# Altium project PCB_TDT4295_NTNU_2013.PrjPcb (part 1 of 2)
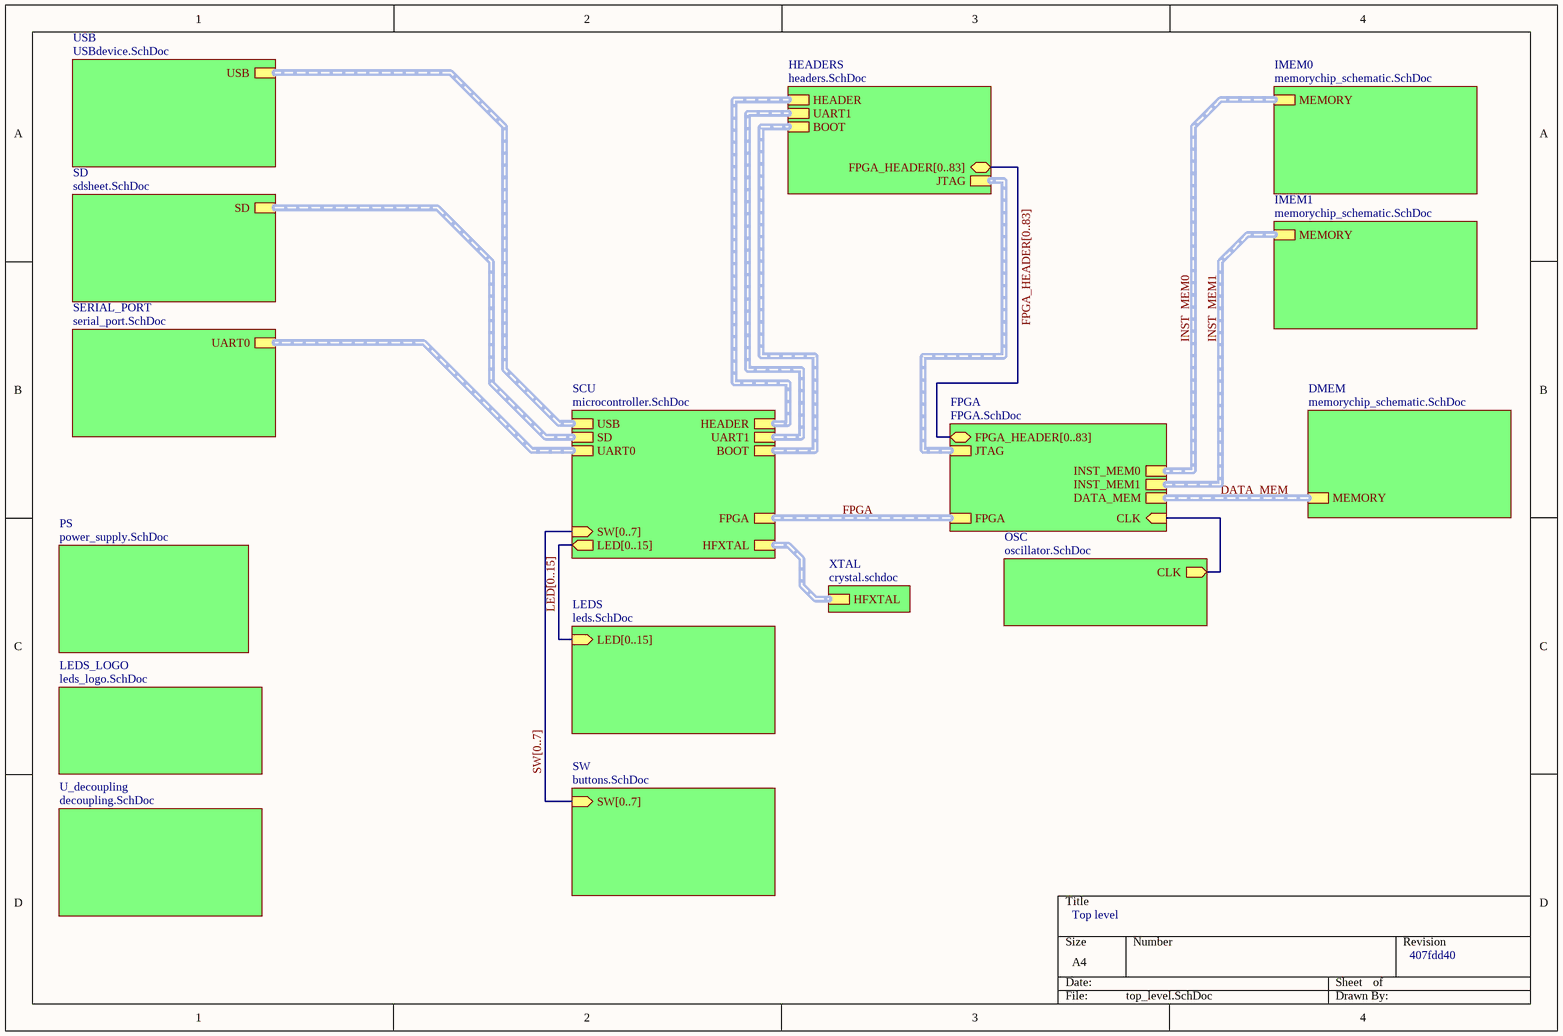
[diagram p0: top_level.SchDoc]
17 sheets, 168 parts. Net scope: hierarchical (ports join the sheet entries above them; power ports are global).
Board file: barricelli.PcbDoc
Sheets:
  top_level.SchDoc
    PS = power_supply.SchDoc
      U_psu_toggle_switch = psu_toggle_switch.SchDoc
    LEDS = leds.SchDoc
    SW = buttons.SchDoc
    SERIAL_PORT = serial_port.SchDoc
    IMEM0 = memorychip_schematic.SchDoc
    IMEM1 = memorychip_schematic.SchDoc
    DMEM = memorychip_schematic.SchDoc
    SCU = microcontroller.SchDoc
      U_microcontroller_reset_button = microcontroller_reset_button.schdoc
    FPGA = FPGA.SchDoc
    USB = USBdevice.SchDoc
    SD = sdsheet.SchDoc
    HEADERS = headers.SchDoc
    XTAL = crystal.schdoc
    OSC = oscillator.SchDoc
    LEDS_LOGO = leds_logo.SchDoc
    U_decoupling = decoupling.SchDoc

## Sheet top_level.SchDoc
size A4

### Sub-sheets
DMEM = memorychip_schematic.SchDoc: MEMORY (harness MEMORY)
FPGA = FPGA.SchDoc: FPGA (harness FPGA), DATA_MEM (harness MEMORY), INST_MEM0 (harness MEMORY), INST_MEM1 (harness MEMORY), JTAG (harness FPGA JTAG), CLK (in), FPGA_HEADER[0..83] (bidir)
HEADERS = headers.SchDoc: FPGA_HEADER[0..83] (bidir), UART1 (harness UART1), BOOT (harness BOOT), HEADER (harness HEADER), JTAG (harness FPGA JTAG)
IMEM0 = memorychip_schematic.SchDoc: MEMORY (harness MEMORY)
IMEM1 = memorychip_schematic.SchDoc: MEMORY (harness MEMORY)
LEDS = leds.SchDoc: LED[0..15] (in)
LEDS_LOGO = leds_logo.SchDoc: no entries
OSC = oscillator.SchDoc: CLK (out)
PS = power_supply.SchDoc: no entries
SCU = microcontroller.SchDoc: SW[0..7] (in), LED[0..15] (out), UART0 (harness UART0), FPGA (harness FPGA), HFXTAL (harness HFXTAL), UART1 (harness UART1), USB (harness USB), BOOT (harness BOOT), SD (harness SD), HEADER (harness HEADER)
SD = sdsheet.SchDoc: SD (harness SD)
SERIAL_PORT = serial_port.SchDoc: UART0 (harness UART0)
SW = buttons.SchDoc: SW[0..7] (in)
U_decoupling = decoupling.SchDoc: no entries
USB = USBdevice.SchDoc: USB (harness USB)
XTAL = crystal.schdoc: HFXTAL (harness HFXTAL)

### Nets
CLK: sheet FPGA/CLK, sheet OSC/CLK

### Buses and harness runs
bus FPGA_HEADER[0..83] = sheet FPGA/FPGA_HEADER[0..83] = sheet HEADERS/FPGA_HEADER[0..83]
bus LED[0..15] = sheet LEDS/LED[0..15] = sheet SCU/LED[0..15]
bus SW[0..7] = sheet SCU/SW[0..7] = sheet SW/SW[0..7]
harness DATA_MEM = sheet DMEM/MEMORY = sheet FPGA/DATA_MEM
harness FPGA = sheet FPGA/FPGA = sheet SCU/FPGA
harness INST_MEM0 = sheet FPGA/INST_MEM0 = sheet IMEM0/MEMORY
harness INST_MEM1 = sheet FPGA/INST_MEM1 = sheet IMEM1/MEMORY
harness sheet FPGA/JTAG = sheet HEADERS/JTAG
harness sheet HEADERS/BOOT = sheet SCU/BOOT
harness sheet HEADERS/HEADER = sheet SCU/HEADER
harness sheet HEADERS/UART1 = sheet SCU/UART1
harness sheet SCU/HFXTAL = sheet XTAL/HFXTAL
harness sheet SCU/SD = sheet SD/SD
harness sheet SCU/UART0 = sheet SERIAL_PORT/UART0
harness sheet SCU/USB = sheet USB/USB

### Notes on the sheet
- Top level
- 407fdd40

## Sheet power_supply.SchDoc
size A4
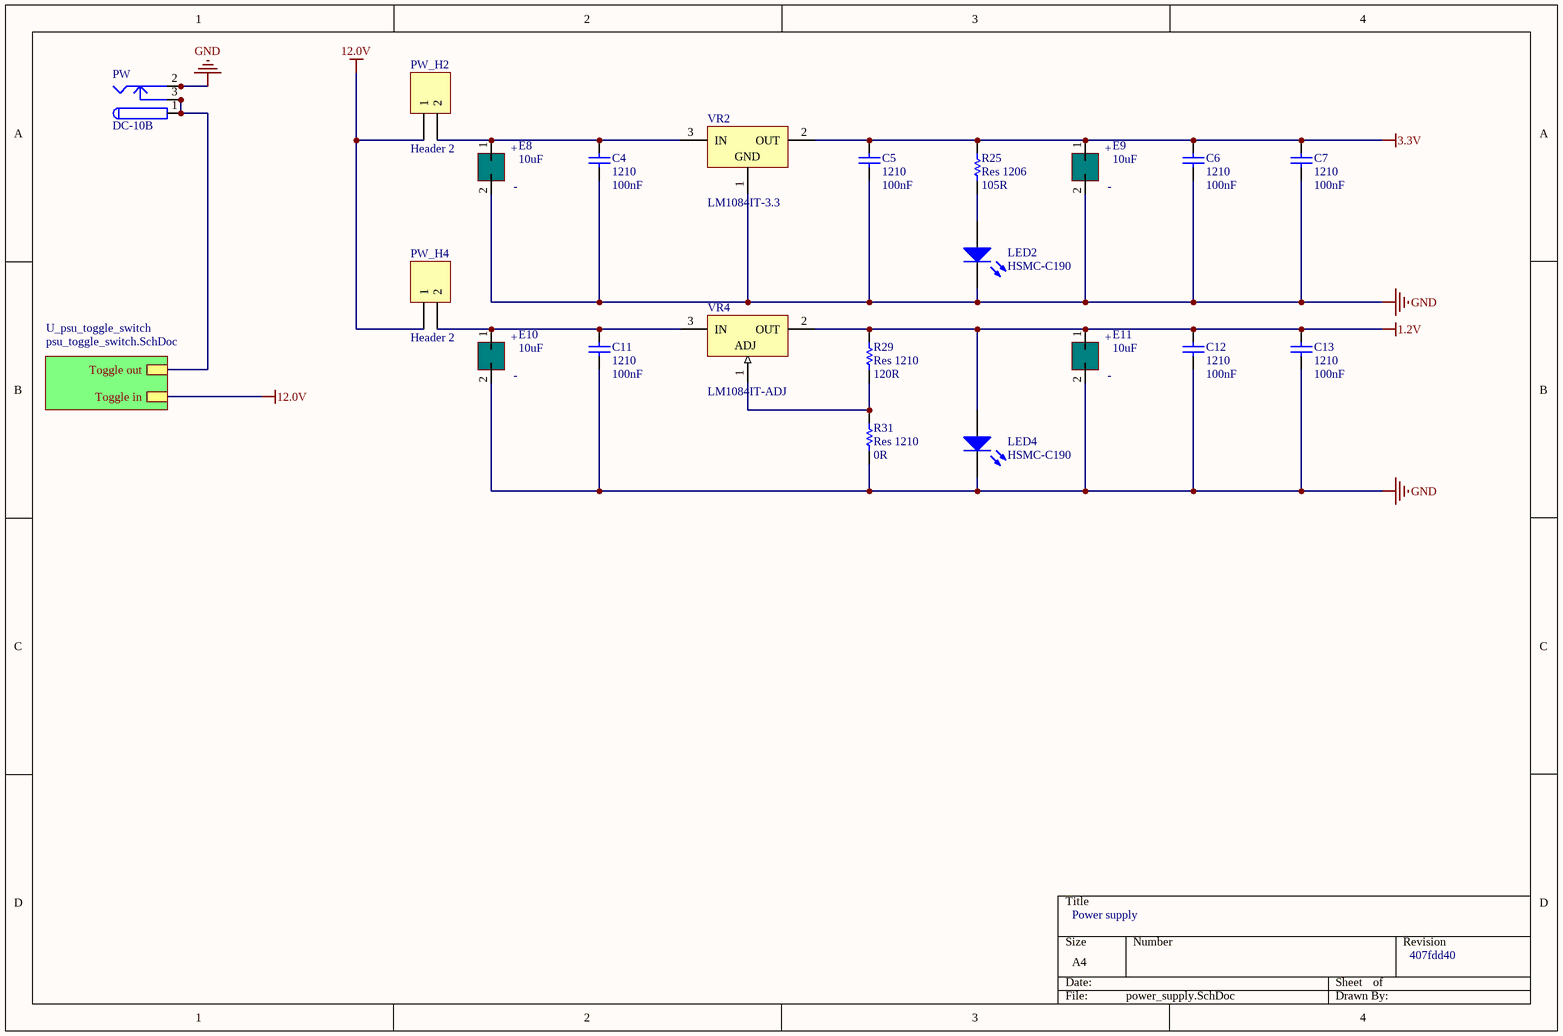
[diagram p1: power_supply.SchDoc]

### Parts
C4  1210  value 100nF  [CAPC1210(3225)105_L]
C5  1210  value 100nF  [CAPC1210(3225)105_L]
C6  1210  value 100nF  [CAPC1210(3225)105_L]
C7  1210  value 100nF  [CAPC1210(3225)105_L]
C11  1210  value 100nF  [CAPC1210(3225)105_L]
C12  1210  value 100nF  [CAPC1210(3225)105_L]
C13  1210  value 100nF  [CAPC1210(3225)105_L]
E8  10uF  [cap_pol_size_B]
E9  10uF  [cap_pol_size_B]
E10  10uF  [cap_pol_size_B]
E11  10uF  [cap_pol_size_B]
LED2  HSMC-C190  [1.6X0.8X0.8]
LED4  HSMC-C190  [1.6X0.8X0.8]
PW  DC-10B  [KLD-0202]
PW_H2  Header 2  [HDR1X2]
PW_H4  Header 2  [HDR1X2]
R25  Res 1206  value 105R  [RESC1206(3216)_L]
R29  Res 1210  value 120R  [RESC1210(3225)_M]
R31  Res 1210  value 0R  [RESC1210(3225)_M]
VR2  LM1084IT-3.3  [T03B]
VR4  LM1084IT-ADJ  [T03B]

### Sub-sheets
U_psu_toggle_switch = psu_toggle_switch.SchDoc: Toggle in, Toggle out

### Nets
1.2V: C12.2 C13.2 E11.1 LED4.1(A) R29.2 VR4.2(OUT)
3.3V: C5.2 C6.2 C7.2 E9.1 R25.1 VR2.2(OUT)
12.0V: PW_H2.1 PW_H4.1 ; sheet U_psu_toggle_switch/Toggle in
GND: C4.1 C5.1 C6.1 C7.1 C11.1 C12.1 C13.1 E8.2 E9.2 E10.2 E11.2 LED2.2(K) LED4.2(K) PW.2 PW.2A PW.2B R31.1 VR2.1(GND)
Toggle out: PW.1 PW.1A PW.1B PW.3 PW.3A PW.3B ; sheet U_psu_toggle_switch/Toggle out
NetC4_2: C4.2 E8.1 PW_H2.2 VR2.3(IN)
NetC11_2: C11.2 E10.1 PW_H4.2 VR4.3(IN)
NetLED2_1: LED2.1(A) R25.2
NetR29_1: R29.1 R31.2 VR4.1(ADJ)

### Notes on the sheet
- Power supply
- 407fdd40
- (in symbol CAP_POL_SIZE_B) +; -

### Library data of the parts
C4-C7 C11-C13 = CMP-1038-01663-1: CAP 100nF 100V ±5% 1210 (3225 Metric) Thickness 1.05mm SMD; Case-Metric: 3225; Max Thickness: 1.05 mm; Rated Voltage: 100 V; Tolerance: ±5%; Case-EIA: 1210; Technology: SMT
E8-E11 = CAP_POL_SIZE_B: size B series S type V capacitor, panasonic elec
LED2 LED4 = HSMC-C190: High Performance Chip LED, Red; LuminousIntensity: 25mcd (Minimum).; PCB_Layout: Complies with manufacturer's recommendation.; Published: 11-Dec-2002; DatasheetVersion: 11-Mar-2002; PackageVersion: Mar-2002; PackageReference: 1.6X0.8X0.8; Publisher: Altium Limited; PackageDescription: SM LED; 2 Flat Leads; LED_Colour: Red; ComponentLink1Description: Manufacturer Link; ComponentLink1URL: http://www.avagotech.com/; ComponentLink2Description: Datasheet; ComponentLink2URL: http://cp.literature.agilent.com/litweb/pdf/5988-5891EN.pdf
PW = PWR2.5: Low Voltage Power Supply Connector; Published: 17-Dec-2003; DatasheetDocument: 09-May-2002; Publisher: Altium Limited; ComponentLink1Description: Manufacturer Link; ComponentLink1URL: http://domino.kycon.com/internet/Products.html
PW_H2 PW_H4 = Header 2: Header, 2-Pin; LatestRevisionDate: 17-Jul-2002; LatestRevisionNote: Re-released for DXP Platform.; Publisher: Altium Limited
R25 = CMP-1014-00056-1: 105R 0.25W 5% 1206 (3216 Metric)  SMD; Case-Metric: 3216; Case-EIA: 1206; Technology: SMT; Tolerance: 5 %; Power: 0.25 W
R29 = CMP-1015-00405-1: 120R 0.5W 1% 1210 (3225 Metric)  SMD; Case-Metric: 3225; Case-EIA: 1210; Technology: SMT; Tolerance: 1 %; Power: 0.5 W
R31 = CMP-1015-00405-1: 0R 0.5W 1% 1210 (3225 Metric)  SMD; Case-Metric: 3225; Case-EIA: 1210; Technology: SMT; Tolerance: 1 %; Power: 0.5 W
VR2 = LM1084IT-3.3: 5A Low Dropout Positive Regulators, 3-pin TO-220; Manufacturer: National Semiconductor; PackageTopMarking: NSUZXYTTE#*LM1084*IT-3.3; PowerWise: N; CompType: LDO IC; Published: 4-Dec-2008; DatasheetVersion: Jun-2005; PackageVersion: revL, Jan-1992; PackageReference: T03B; Publisher: Altium Limited; PackageDescription: TO-220, Molded, 3 Lead, Straight; Supplier 1: Farnell; Supplier Part Number 1: 4975467; PartNumber: LM1084IT-3.3; RoHS: N; PinCount: 3; ComponentLink1Description: LM1084 Datasheet; ComponentLink1URL: http://www.national.com/ds/LM/LM1084.pdf; ComponentLink2Description: LM1084 Web Page; ComponentLink2URL: http://www.national.com/pf/LM/LM1084.html; ComponentLink3Description: T03B Package Page; ComponentLink3URL: http://www.national.com/packaging/folders/t03b.html
VR4 = LM1084IT-ADJ: 5A Low Dropout Positive Regulators, 3-pin TO-220; Manufacturer: National Semiconductor; PackageTopMarking: NSUZXYTTE#*LM1084*IT-ADJ; PowerWise: N; CompType: LDO IC; Published: 4-Dec-2008; DatasheetVersion: Jun-2005; PackageVersion: revL, Jan-1992; PackageReference: T03B; Publisher: Altium Limited; PackageDescription: TO-220, Molded, 3 Lead, Straight; Supplier 1: Farnell; Supplier Part Number 1: 7610087; PartNumber: LM1084IT-ADJ; RoHS: N; PinCount: 3; ComponentLink1Description: LM1084 Datasheet; ComponentLink1URL: http://www.national.com/ds/LM/LM1084.pdf; ComponentLink2Description: LM1084 Web Page; ComponentLink2URL: http://www.national.com/pf/LM/LM1084.html; ComponentLink3Description: T03B Package Page; ComponentLink3URL: http://www.national.com/packaging/folders/t03b.html

## Sheet psu_toggle_switch.SchDoc
size A4
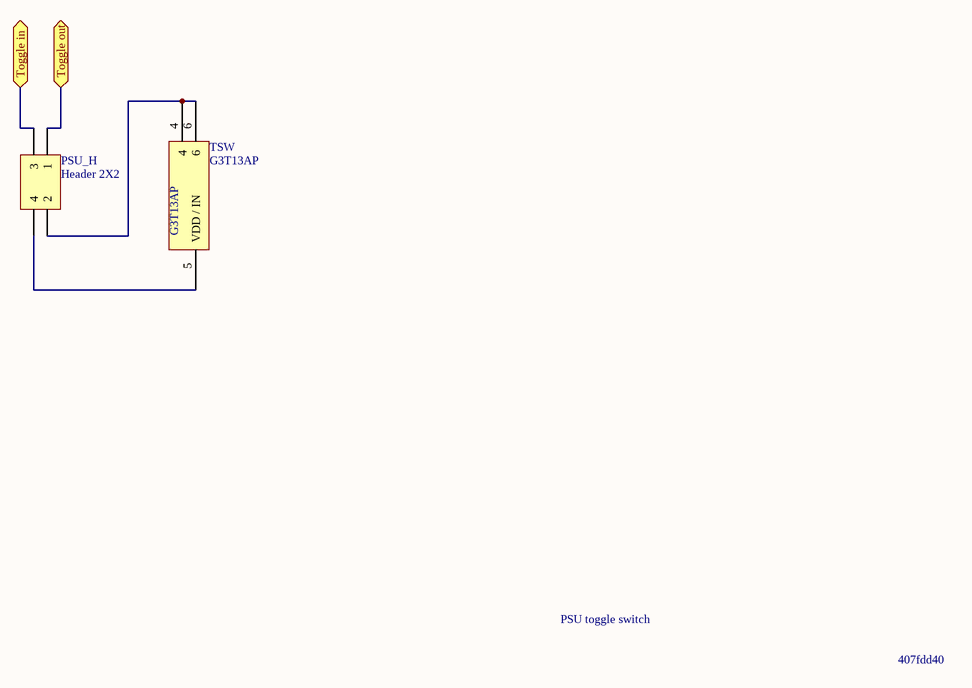
[diagram p2: psu_toggle_switch.SchDoc]

### Parts
PSU_H  Header 2X2  [HDR2X2]
TSW  G3T13AP  [G3T13AP]

### Ports
Toggle in, Toggle out

### Nets
12.0V: PSU_H.3 ; port Toggle in
Toggle out: PSU_H.1 ; port Toggle out
NetPSU_H_2: PSU_H.2 TSW.4 TSW.6
NetPSU_H_4: PSU_H.4 TSW.5(VDD_/_IN)

### Notes on the sheet
- PSU toggle switch
- 407fdd40

### Library data of the parts
PSU_H = Header 2X2: Header, 2-Pin, Dual row; LatestRevisionDate: 17-Jul-2002; LatestRevisionNote: Re-released for DXP Platform.; Publisher: Altium Limited

## Sheet leds.SchDoc
size A4
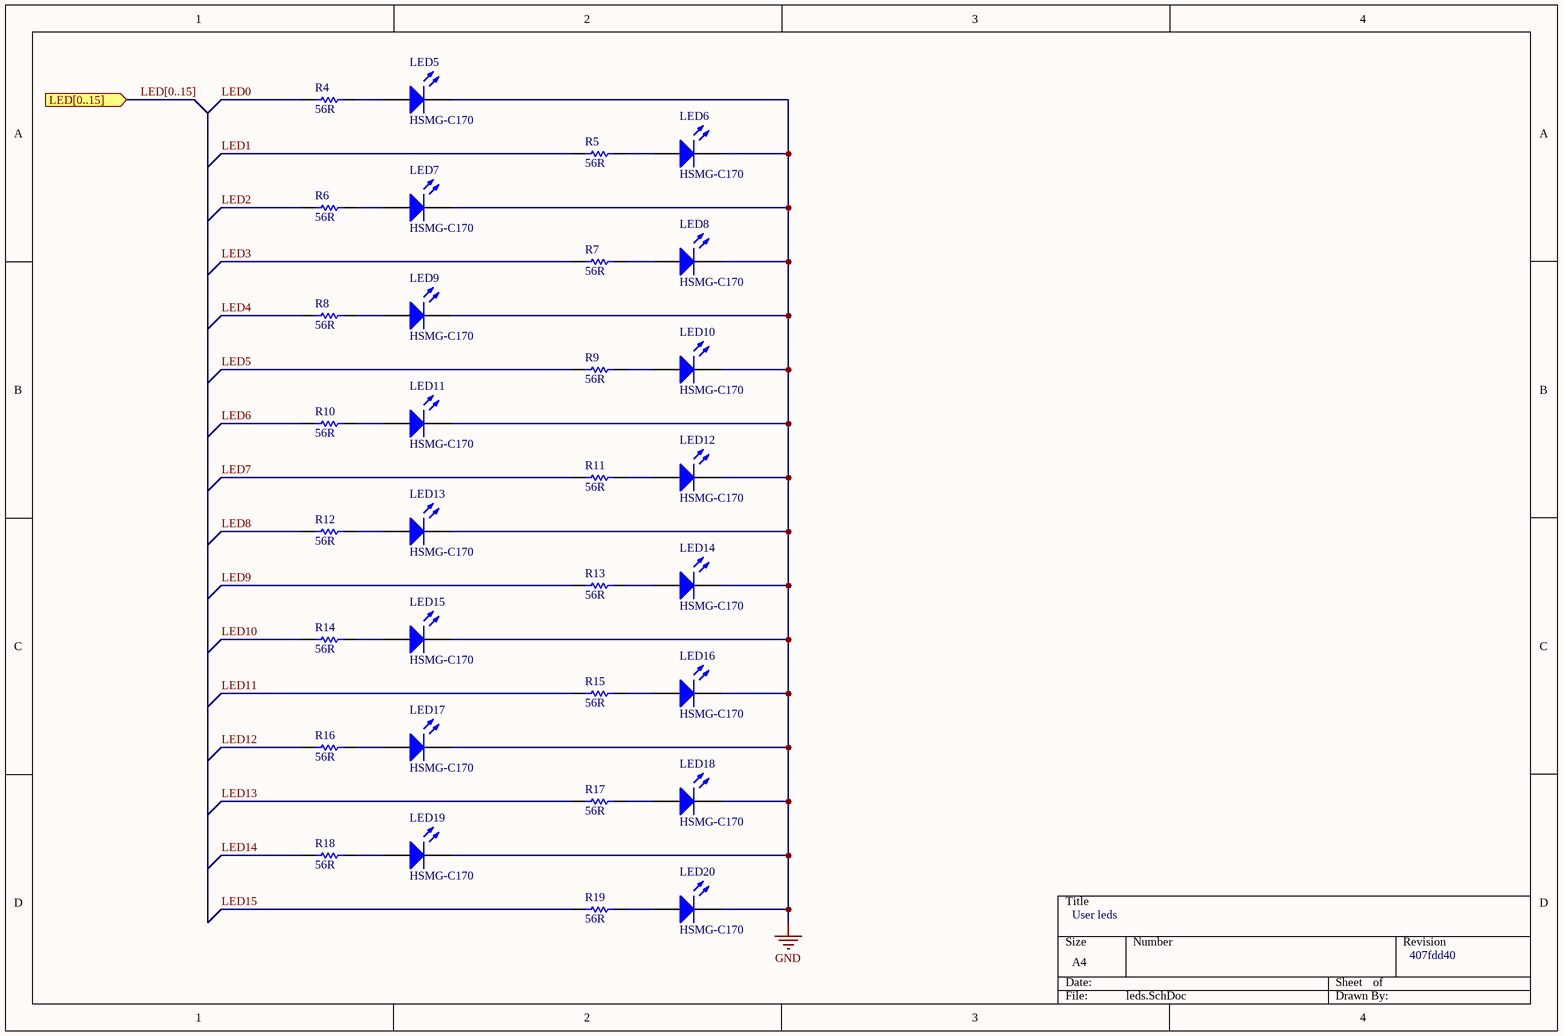
[diagram p3: leds.SchDoc]

### Parts
LED5  HSMG-C170  [2.0X1.25X0.8]
LED6  HSMG-C170  [2.0X1.25X0.8]
LED7  HSMG-C170  [2.0X1.25X0.8]
LED8  HSMG-C170  [2.0X1.25X0.8]
LED9  HSMG-C170  [2.0X1.25X0.8]
LED10  HSMG-C170  [2.0X1.25X0.8]
LED11  HSMG-C170  [2.0X1.25X0.8]
LED12  HSMG-C170  [2.0X1.25X0.8]
LED13  HSMG-C170  [2.0X1.25X0.8]
LED14  HSMG-C170  [2.0X1.25X0.8]
LED15  HSMG-C170  [2.0X1.25X0.8]
LED16  HSMG-C170  [2.0X1.25X0.8]
LED17  HSMG-C170  [2.0X1.25X0.8]
LED18  HSMG-C170  [2.0X1.25X0.8]
LED19  HSMG-C170  [2.0X1.25X0.8]
LED20  HSMG-C170  [2.0X1.25X0.8]
R4  value 56R  [RESC1206(3216)_N]  (hidden comment: 56R 5% 1206(3216))
R5  value 56R  [RESC1206(3216)_N]  (hidden comment: 56R 5% 1206(3216))
R6  value 56R  [RESC1206(3216)_N]  (hidden comment: 56R 5% 1206(3216))
R7  value 56R  [RESC1206(3216)_N]  (hidden comment: 56R 5% 1206(3216))
R8  value 56R  [RESC1206(3216)_N]  (hidden comment: 56R 5% 1206(3216))
R9  value 56R  [RESC1206(3216)_N]  (hidden comment: 56R 5% 1206(3216))
R10  value 56R  [RESC1206(3216)_N]  (hidden comment: 56R 5% 1206(3216))
R11  value 56R  [RESC1206(3216)_N]  (hidden comment: 56R 5% 1206(3216))
R12  value 56R  [RESC1206(3216)_N]  (hidden comment: 56R 5% 1206(3216))
R13  value 56R  [RESC1206(3216)_N]  (hidden comment: 56R 5% 1206(3216))
R14  value 56R  [RESC1206(3216)_N]  (hidden comment: 56R 5% 1206(3216))
R15  value 56R  [RESC1206(3216)_N]  (hidden comment: 56R 5% 1206(3216))
R16  value 56R  [RESC1206(3216)_N]  (hidden comment: 56R 5% 1206(3216))
R17  value 56R  [RESC1206(3216)_N]  (hidden comment: 56R 5% 1206(3216))
R18  value 56R  [RESC1206(3216)_N]  (hidden comment: 56R 5% 1206(3216))
R19  value 56R  [RESC1206(3216)_N]  (hidden comment: 56R 5% 1206(3216))

### Ports
LED[0..15] (in)

### Nets
GND: LED5.2(K) LED6.2(K) LED7.2(K) LED8.2(K) LED9.2(K) LED10.2(K) LED11.2(K) LED12.2(K) LED13.2(K) LED14.2(K) LED15.2(K) LED16.2(K) LED17.2(K) LED18.2(K) LED19.2(K) LED20.2(K)
LED0: R4.1
LED1: R5.1
LED2: R6.1
LED3: R7.1
LED4: R8.1
LED5: R9.1
LED6: R10.1
LED7: R11.1
LED8: R12.1
LED9: R13.1
LED10: R14.1
LED11: R15.1
LED12: R16.1
LED13: R17.1
LED14: R18.1
LED15: R19.1
NetLED5_1: LED5.1(A) R4.2
NetLED6_1: LED6.1(A) R5.2
NetLED7_1: LED7.1(A) R6.2
NetLED8_1: LED8.1(A) R7.2
NetLED9_1: LED9.1(A) R8.2
NetLED10_1: LED10.1(A) R9.2
NetLED11_1: LED11.1(A) R10.2
NetLED12_1: LED12.1(A) R11.2
NetLED13_1: LED13.1(A) R12.2
NetLED14_1: LED14.1(A) R13.2
NetLED15_1: LED15.1(A) R14.2
NetLED16_1: LED16.1(A) R15.2
NetLED17_1: LED17.1(A) R16.2
NetLED18_1: LED18.1(A) R17.2
NetLED19_1: LED19.1(A) R18.2
NetLED20_1: LED20.1(A) R19.2

### Buses and harness runs
bus LED[0..15] = port LED[0..15]

### Notes on the sheet
- User leds
- 407fdd40

### Library data of the parts
LED5-LED20 = HSMG-C170: Surface Mount Chip LED, Green; LuminousIntensity: 4mcd (Minimum).; PCB_Layout: Complies with manufacturer's recommendation.; Published: 11-Dec-2002; DatasheetVersion: 30-Apr-2002; PackageVersion: Oct-2001; PackageReference: 2.0X1.25X0.8; Publisher: Altium Limited; PackageDescription: SM LED; 2 Flat Leads; LED_Colour: Green; ComponentLink1Description: Manufacturer Link; ComponentLink1URL: http://www.avagotech.com/; ComponentLink2Description: Datasheet; ComponentLink2URL: http://cp.literature.agilent.com/litweb/pdf/5988-6271EN.pdf
R4-R19 = CMP-1014-00044-1: 56R 0.25W 5% 1206 (3216 Metric)  SMD; Case-EIA: 1206; Case-Metric: 3216; Technology: SMT; Tolerance: 5 %; Power: 0.25 W

## Sheet buttons.SchDoc
size A4
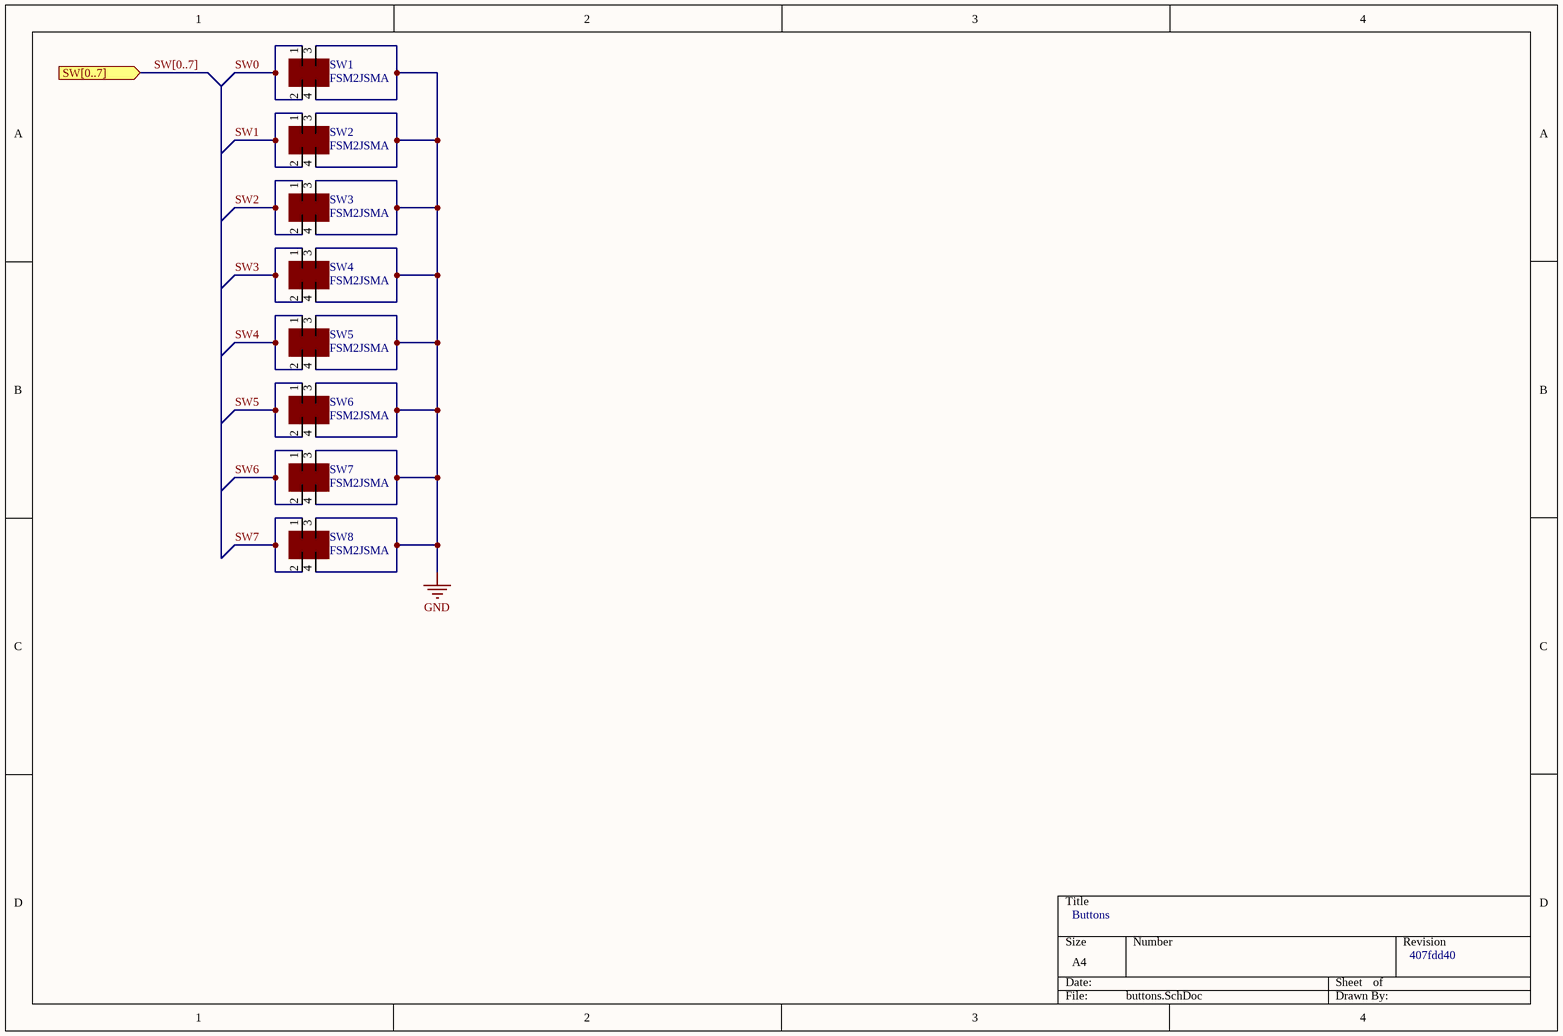
[diagram p4: buttons.SchDoc]

### Parts
SW1  FSM2JSMA  [Button]
SW2  FSM2JSMA  [Button]
SW3  FSM2JSMA  [Button]
SW4  FSM2JSMA  [Button]
SW5  FSM2JSMA  [Button]
SW6  FSM2JSMA  [Button]
SW7  FSM2JSMA  [Button]
SW8  FSM2JSMA  [Button]

### Ports
SW[0..7] (in)

### Nets
GND: SW1.3 SW1.4 SW2.3 SW2.4 SW3.3 SW3.4 SW4.3 SW4.4 SW5.3 SW5.4 SW6.3 SW6.4 SW7.3 SW7.4 SW8.3 SW8.4
SW0: SW1.1 SW1.2
SW1: SW2.1 SW2.2
SW2: SW3.1 SW3.2
SW3: SW4.1 SW4.2
SW4: SW5.1 SW5.2
SW5: SW6.1 SW6.2
SW6: SW7.1 SW7.2
SW7: SW8.1 SW8.2

### Buses and harness runs
bus SW[0..7] = port SW[0..7]

### Notes on the sheet
- Buttons
- 407fdd40

### Library data of the parts
SW1-SW8 = switch-button

## Sheet serial_port.SchDoc
size A4
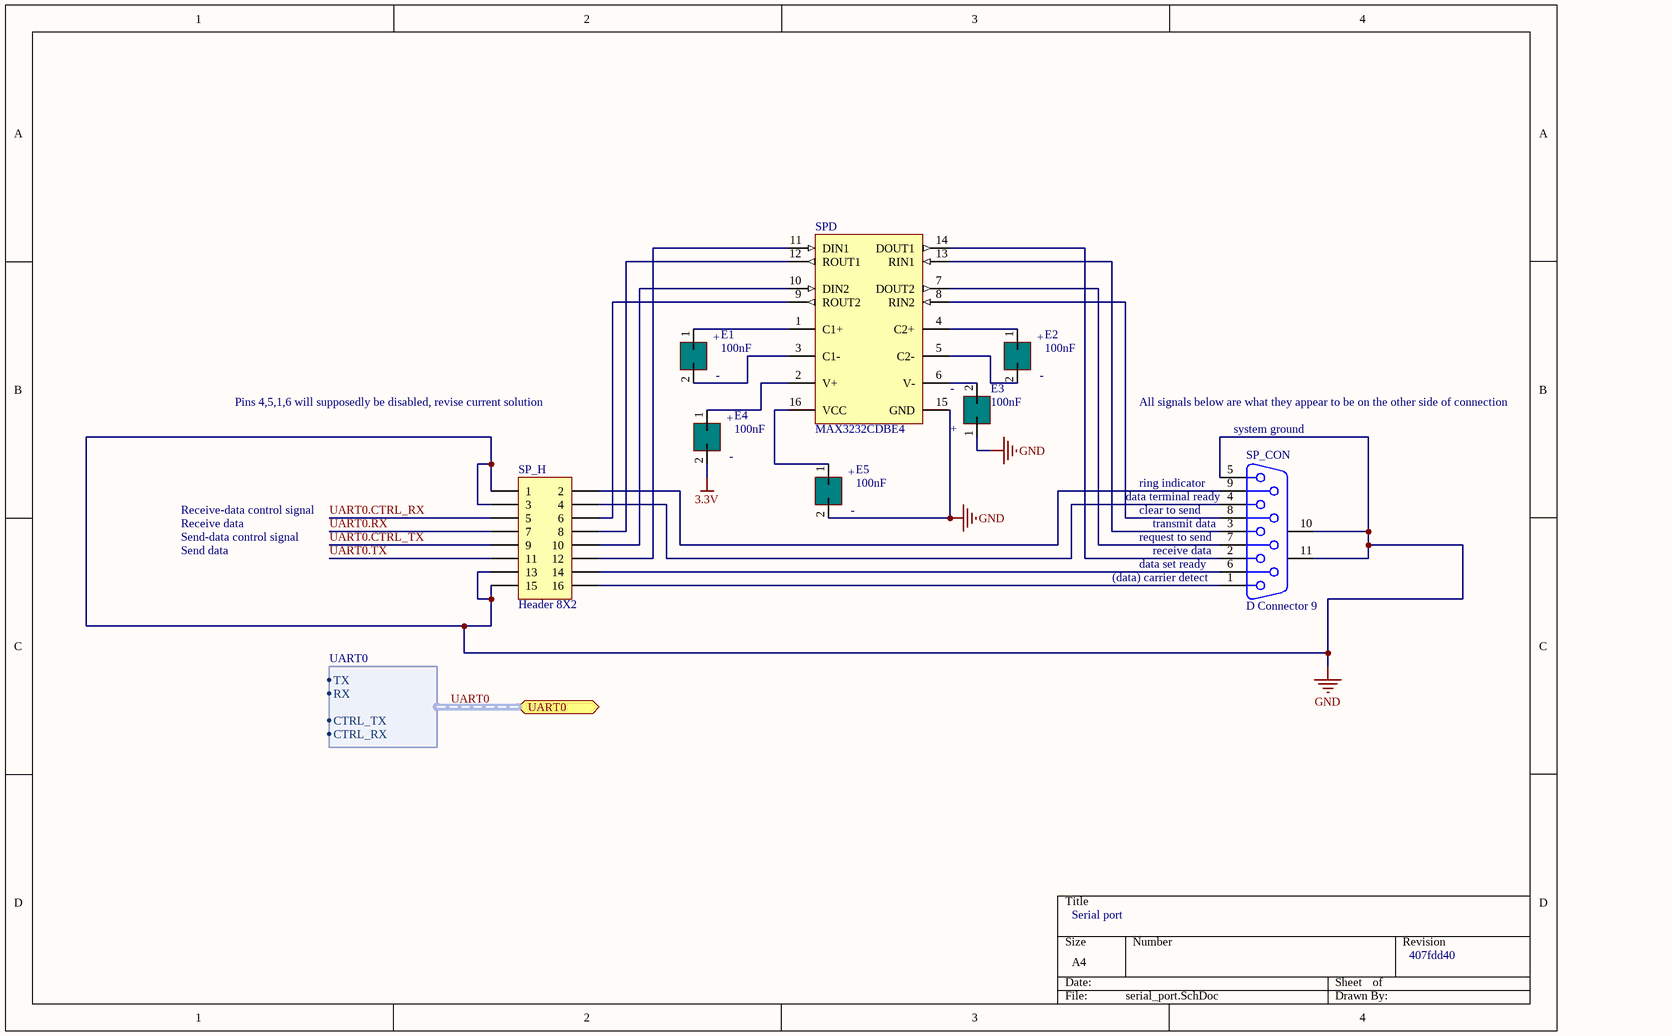
[diagram p5: serial_port.SchDoc]

### Parts
E1  100nF  [cap_pol_size_B]
E2  100nF  [cap_pol_size_B]
E3  100nF  [cap_pol_size_B]
E4  100nF  [cap_pol_size_B]
E5  100nF  [cap_pol_size_B]
SP_CON  D Connector 9  [DSUB1.385-2H9]
SP_H  Header 8X2  [HDR2X8]
SPD  MAX3232CDBE4  [TI-DB16_L]

### Ports
UART0 (harness UART0)

### Harnesses
UART0: TX, RX, CTRL_TX, CTRL_RX

### Nets
3.3V: E4.2
GND: E3.1 E5.2 SP_CON.5 SP_CON.10(MH1) SP_CON.11(MH2) SP_H.1 SP_H.3 SP_H.13 SP_H.15 SPD.15(GND)
UART0.CTRL_RX: SP_H.5
UART0.CTRL_TX: SP_H.9
UART0.RX: SP_H.7
UART0.TX: SP_H.11
NetE1_1: E1.1 SPD.1(C1+)
NetE1_2: E1.2 SPD.3(C1-)
NetE2_1: E2.1 SPD.4(C2+)
NetE2_2: E2.2 SPD.5(C2-)
NetE3_2: E3.2 SPD.6(V-)
NetE4_1: E4.1 SPD.2(V+)
NetE5_1: E5.1 SPD.16(VCC)
NetSP_CON_1: SP_CON.1 SP_H.16
NetSP_CON_2: SP_CON.2 SPD.14(DOUT1)
NetSP_CON_3: SP_CON.3 SPD.13(RIN1)
NetSP_CON_4: SP_CON.4 SP_H.4
NetSP_CON_6: SP_CON.6 SP_H.14
NetSP_CON_7: SP_CON.7 SPD.7(DOUT2)
NetSP_CON_8: SP_CON.8 SPD.8(RIN2)
NetSP_CON_9: SP_CON.9 SP_H.2
NetSP_H_6: SP_H.6 SPD.9(ROUT2)
NetSP_H_8: SP_H.8 SPD.12(ROUT1)
NetSP_H_10: SP_H.10 SPD.10(DIN2)
NetSP_H_12: SP_H.12 SPD.11(DIN1)

### Buses and harness runs
harness UART0 = port UART0

### Notes on the sheet
- Pins 4,5,1,6 will supposedly be disabled, revise current solution
- All signals below are what they appear to be on the other side of connection
- (near SP_CON) system ground
- Receive-data control signal
- (near SP_CON) data terminal ready
- (near SP_CON) clear to send
- (near SP_CON) ring indicator
- Send data
- Send-data control signal
- Receive data
- (near SP_CON) (data) carrier detect
- (near SP_CON) request to send
- (near SP_CON) data set ready
- (near SP_CON) transmit data
- (near SP_CON) receive data
- Serial port
- 407fdd40
- (in symbol CAP_POL_SIZE_B) +; -

### Library data of the parts
E1-E5 = CAP_POL_SIZE_B: as E8 on sheet power_supply
SP_CON = D Connector 9: Receptacle Assembly, 9 Position, Right Angle; PackageDocument: O; Positions: 9; Published: 15-Jun-2001; LatestRevisionDate: 17-Jul-2002; LatestRevisionNote: Re-released for DXP Platform.; DatasheetDocument: 1-Sep-1999; PackageReference: 788750; Publisher: Altium Limited; Orientation: Right Angle; Gender: Receptacle
SP_H = Header 8X2: Header, 8-Pin, Dual row; LatestRevisionDate: 17-Jul-2002; LatestRevisionNote: Re-released for DXP Platform.; Publisher: Altium Limited
SPD = CMP-0299-01177-1: 3-V to 5.5-V Multichannel RS-232 Line Driver / Receiver with ±15-kV ESD Protection, 0 to 70 degC, 16-Pin SSOP (DB), Green (RoHS & no Sb/Br); RS-232: TRUE; Supply Voltage(s)(V): 3.3 or 5.0; ESD HBM(kV): +/-15; ICC(Max)(mA): 1; Drivers Per Package: 2; SubFamily: RS-232; ComponentLink1URL: www.ti.com; ComponentLink3Description: Package Specification; PackageDescription: 16-Pin Plastic Small Outline Package, 6.2 x 5.3 mm Body, 0.65 mm Pitch; ComponentLink2URL: http://www.ti.com/general/docs/lit/getliterature.tsp?genericPartNumber=MAX3232&fileType=pdf; Single Supply: TRUE; ComponentLink3URL: http://www.ti.com/litv/pdf/msso002e; PackageVersion: revE, Dec-2001; ComponentLink1Description: Manufacturer URL; ComponentLink2Description: Datasheet; Receivers Per Package: 2; DatasheetVersion: SLLS410I; PackageReference: DB16

## Sheet memorychip_schematic.SchDoc
size A4
Used 3 times, as channels IMEM0, IMEM1, DMEM. Parts and nets are listed once, with the designators drawn on the sheet.
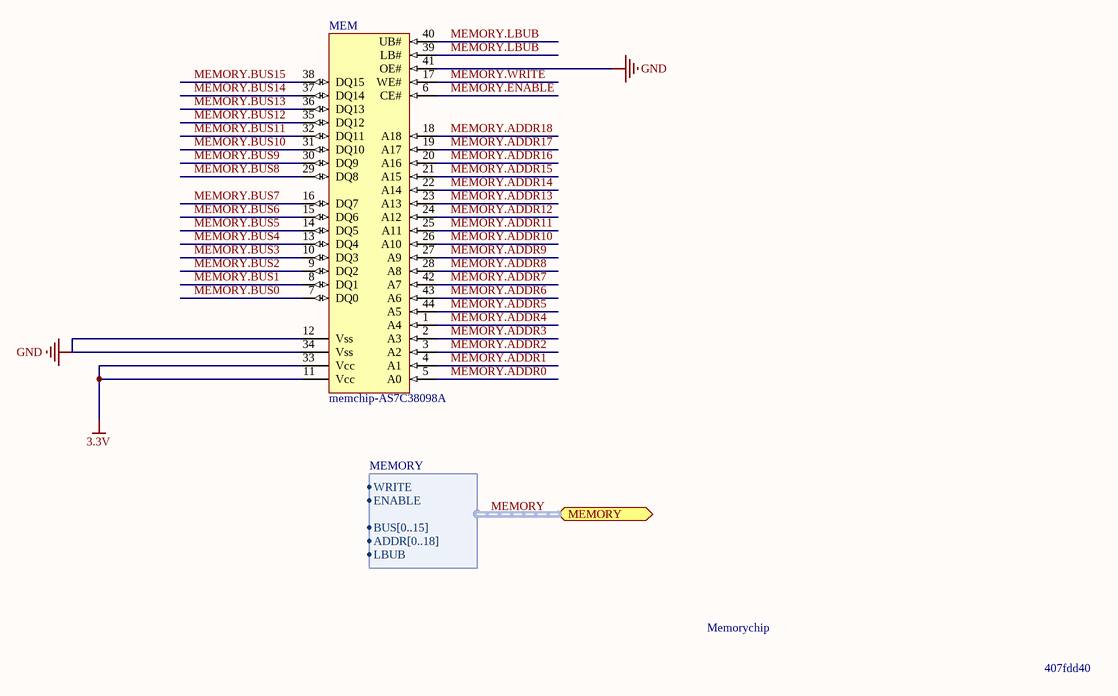
[diagram p6: memorychip_schematic.SchDoc]

### Parts
MEM  memchip-AS7C38098A  [AS7C38098A-10TIN]

### Ports
MEMORY (harness MEMORY)

### Harnesses
MEMORY: WRITE, ENABLE, ADDR[0..18], BUS[0..15], LBUB

### Nets
3.3V: MEM.11(Vcc) MEM.33(Vcc)
GND: MEM.12(Vss) MEM.34(Vss) MEM.41(OE#)
MEMORY.ADDR0: MEM.5(A0)
MEMORY.ADDR1: MEM.4(A1)
MEMORY.ADDR2: MEM.3(A2)
MEMORY.ADDR3: MEM.2(A3)
MEMORY.ADDR4: MEM.1(A4)
MEMORY.ADDR5: MEM.44(A5)
MEMORY.ADDR6: MEM.43(A6)
MEMORY.ADDR7: MEM.42(A7)
MEMORY.ADDR8: MEM.28(A8)
MEMORY.ADDR9: MEM.27(A9)
MEMORY.ADDR10: MEM.26(A10)
MEMORY.ADDR11: MEM.25(A11)
MEMORY.ADDR12: MEM.24(A12)
MEMORY.ADDR13: MEM.23(A13)
MEMORY.ADDR14: MEM.22(A14)
MEMORY.ADDR15: MEM.21(A15)
MEMORY.ADDR16: MEM.20(A16)
MEMORY.ADDR17: MEM.19(A17)
MEMORY.ADDR18: MEM.18(A18)
MEMORY.BUS0: MEM.7(DQ0)
MEMORY.BUS1: MEM.8(DQ1)
MEMORY.BUS2: MEM.9(DQ2)
MEMORY.BUS3: MEM.10(DQ3)
MEMORY.BUS4: MEM.13(DQ4)
MEMORY.BUS5: MEM.14(DQ5)
MEMORY.BUS6: MEM.15(DQ6)
MEMORY.BUS7: MEM.16(DQ7)
MEMORY.BUS8: MEM.29(DQ8)
MEMORY.BUS9: MEM.30(DQ9)
MEMORY.BUS10: MEM.31(DQ10)
MEMORY.BUS11: MEM.32(DQ11)
MEMORY.BUS12: MEM.35(DQ12)
MEMORY.BUS13: MEM.36(DQ13)
MEMORY.BUS14: MEM.37(DQ14)
MEMORY.BUS15: MEM.38(DQ15)
MEMORY.ENABLE: MEM.6(CE#)
MEMORY.LBUB: MEM.39(LB#) MEM.40(UB#)
MEMORY.WRITE: MEM.17(WE#)

### Channels
IMEM0: designators end in _IMEM0
IMEM1: designators end in _IMEM1
DMEM: designators end in _DMEM

### Buses and harness runs
harness MEMORY = port MEMORY

### Notes on the sheet
- Memorychip
- 407fdd40

## Sheet microcontroller.SchDoc
size A3
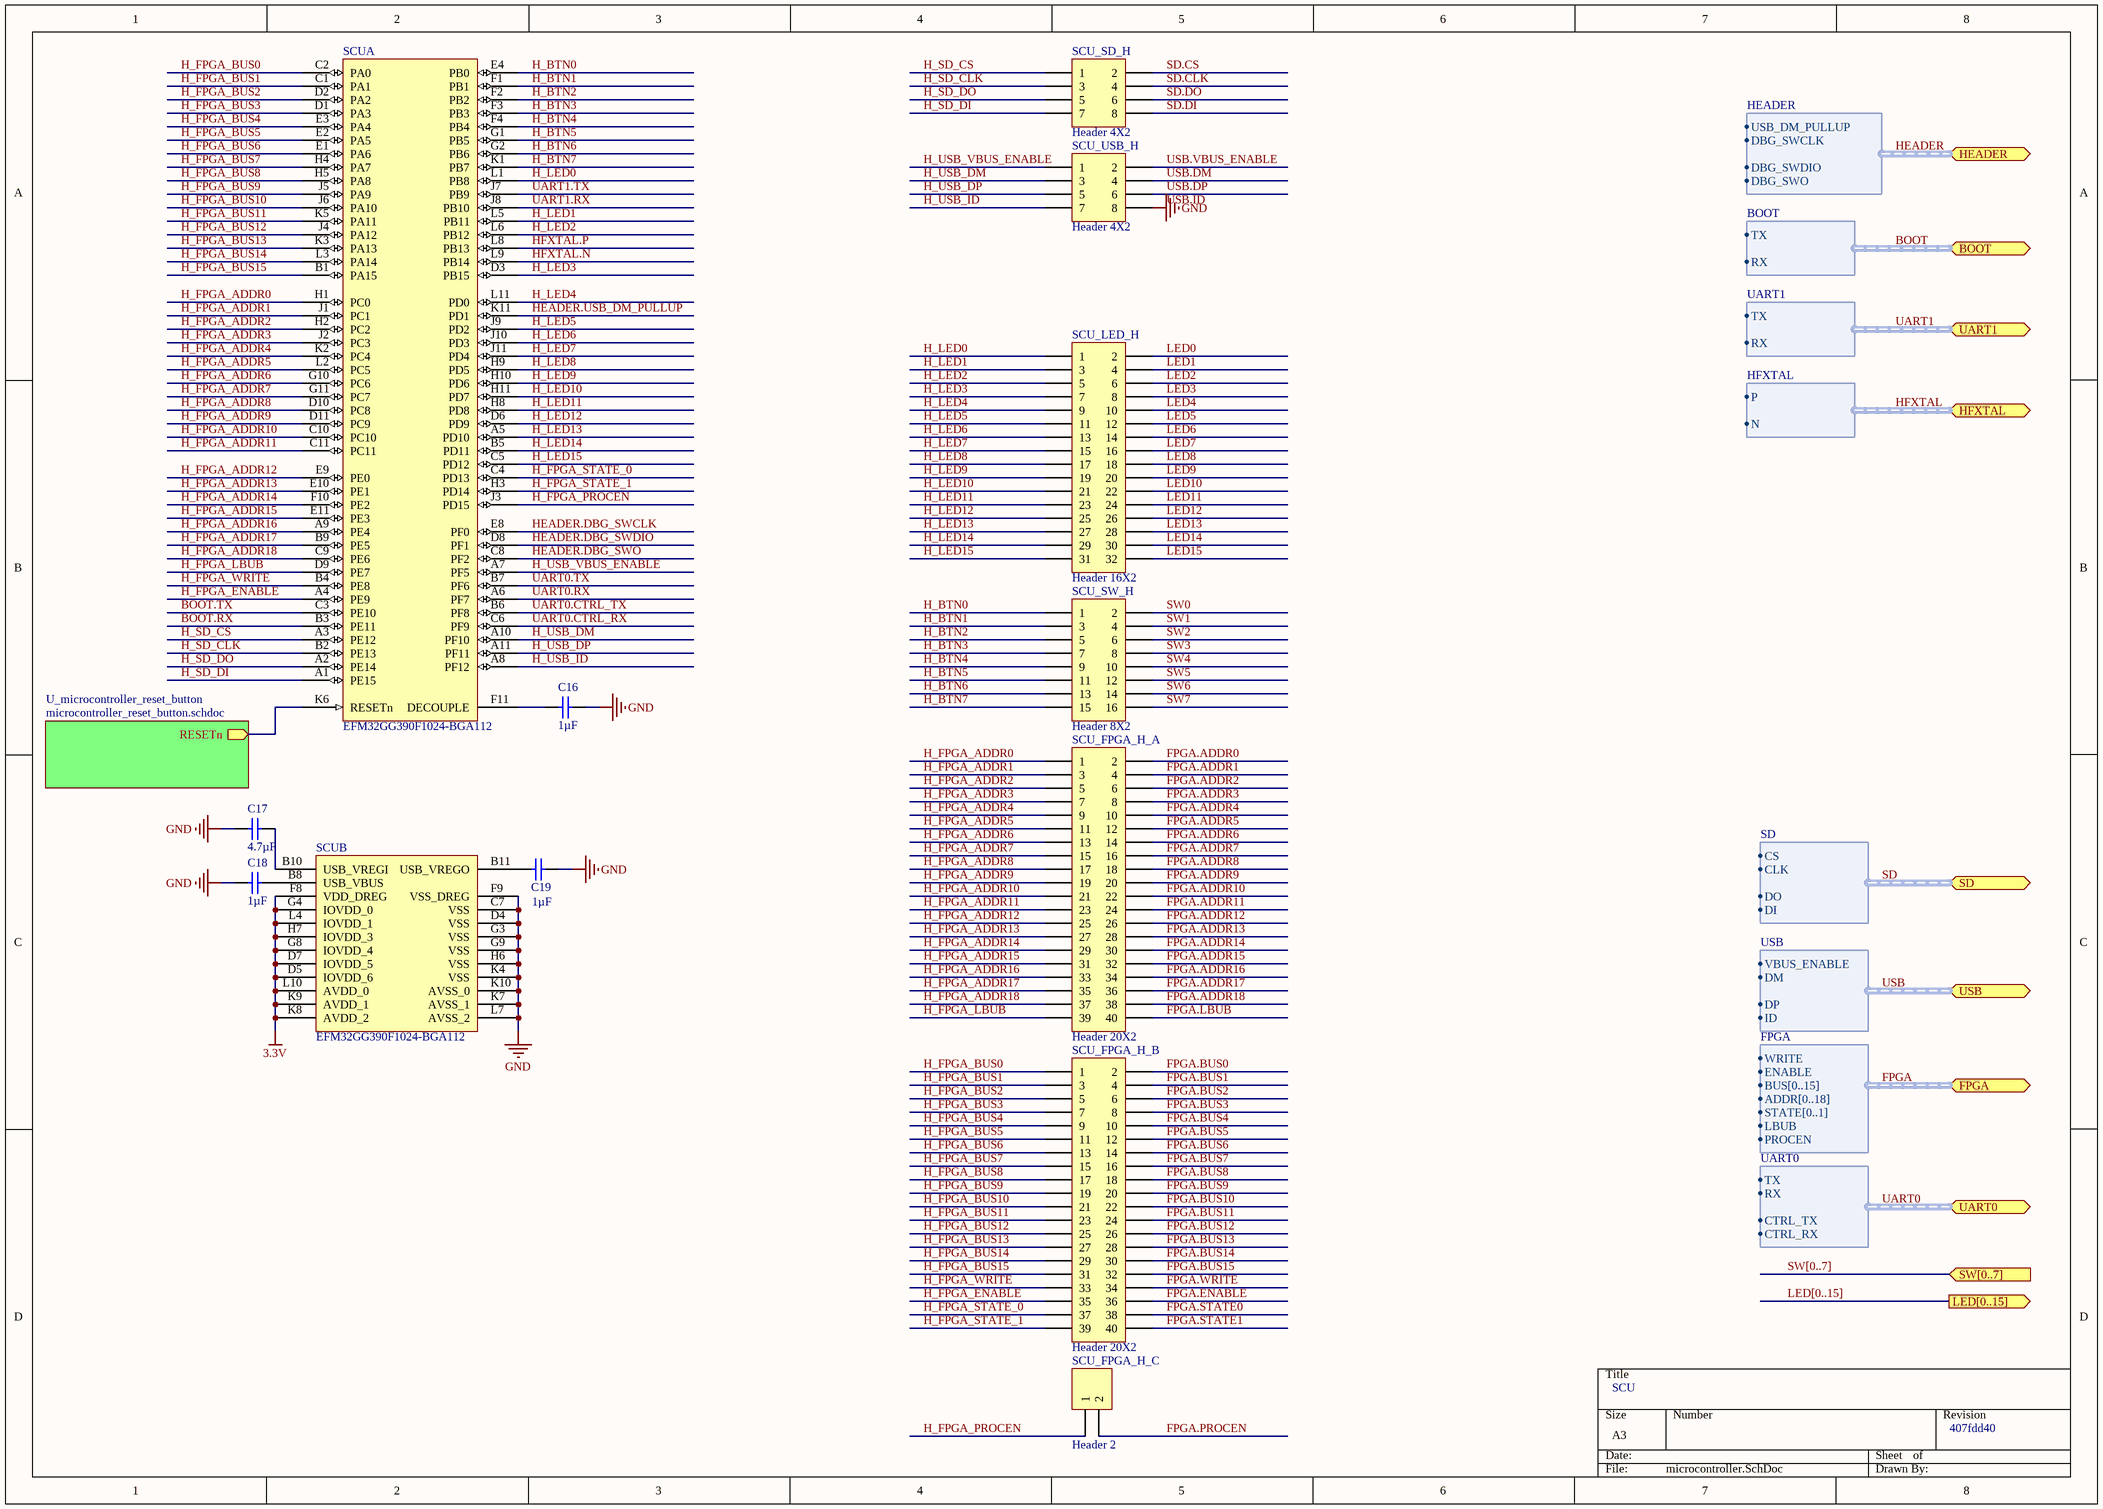
[diagram p7: microcontroller.SchDoc]

### Parts
C16  value 1µF  [CAPC1210(3225)100_L]  (hidden comment: CAP 1uF 100V 1210(3225))
C17  value 4.7µF  [CAPC1210(3225)100_L]  (hidden comment: CAP 4.7uF 100V 1210(3225))
C18  value 1µF  [CAPC1210(3225)100_L]  (hidden comment: CAP 1uF 100V 1210(3225))
C19  value 1µF  [CAPC1210(3225)100_L]  (hidden comment: CAP 1uF 100V 1210(3225))
SCU  EFM32GG390F1024-BGA112  [ENMR-BGA112]  (parts A,B of 2)
SCU_FPGA_H_A  Header 20X2  [HDR2X20]
SCU_FPGA_H_B  Header 20X2  [HDR2X20]
SCU_FPGA_H_C  Header 2  [HDR1X2]
SCU_LED_H  Header 16X2  [HDR2X16]
SCU_SD_H  Header 4X2  [HDR2X4]
SCU_SW_H  Header 8X2  [HDR2X8]
SCU_USB_H  Header 4X2  [HDR2X4]

### Sub-sheets
U_microcontroller_reset_button = microcontroller_reset_button.schdoc: RESETn (out)

### Ports
BOOT (harness BOOT), FPGA (harness FPGA), HEADER (harness HEADER), HFXTAL (harness HFXTAL), LED[0..15] (out), SD (harness SD), SW[0..7] (in), UART0 (harness UART0), UART1 (harness UART1), USB (harness USB)

### Harnesses
UART0: TX, RX, CTRL_TX, CTRL_RX
FPGA: WRITE, ENABLE, ADDR[0..18], STATE[0..1], BUS[0..15], LBUB, PROCEN
HFXTAL: P, N
UART1: TX, RX
USB: VBUS_ENABLE, DM, DP, ID
BOOT: TX, RX
SD: CS, CLK, DO, DI
HEADER: USB_DM_PULLUP, DBG_SWCLK, DBG_SWDIO, DBG_SWO

### Nets
3.3V: SCU.D5(IOVDD_6) SCU.D7(IOVDD_5) SCU.F8(VDD_DREG) SCU.G4(IOVDD_0) SCU.G8(IOVDD_4) SCU.H7(IOVDD_3) SCU.K8(AVDD_2) SCU.K9(AVDD_1) SCU.L4(IOVDD_1) SCU.L10(AVDD_0)
GND: C16.2 C17.2 C18.2 C19.2 SCU.C7(VSS) SCU.D4(VSS) SCU.F9(VSS_DREG) SCU.G3(VSS) SCU.G9(VSS) SCU.H6(VSS) SCU.K4(VSS) SCU.K7(AVSS_1) SCU.K10(AVSS_0) SCU.L7(AVSS_2) SCU_USB_H.8
BOOT.RX: SCU.B3(PE11)
BOOT.TX: SCU.C3(PE10)
FPGA.ADDR0: SCU_FPGA_H_A.2
FPGA.ADDR1: SCU_FPGA_H_A.4
FPGA.ADDR2: SCU_FPGA_H_A.6
FPGA.ADDR3: SCU_FPGA_H_A.8
FPGA.ADDR4: SCU_FPGA_H_A.10
FPGA.ADDR5: SCU_FPGA_H_A.12
FPGA.ADDR6: SCU_FPGA_H_A.14
FPGA.ADDR7: SCU_FPGA_H_A.16
FPGA.ADDR8: SCU_FPGA_H_A.18
FPGA.ADDR9: SCU_FPGA_H_A.20
FPGA.ADDR10: SCU_FPGA_H_A.22
FPGA.ADDR11: SCU_FPGA_H_A.24
FPGA.ADDR12: SCU_FPGA_H_A.26
FPGA.ADDR13: SCU_FPGA_H_A.28
FPGA.ADDR14: SCU_FPGA_H_A.30
FPGA.ADDR15: SCU_FPGA_H_A.32
FPGA.ADDR16: SCU_FPGA_H_A.34
FPGA.ADDR17: SCU_FPGA_H_A.36
FPGA.ADDR18: SCU_FPGA_H_A.38
FPGA.BUS0: SCU_FPGA_H_B.2
FPGA.BUS1: SCU_FPGA_H_B.4
FPGA.BUS2: SCU_FPGA_H_B.6
FPGA.BUS3: SCU_FPGA_H_B.8
FPGA.BUS4: SCU_FPGA_H_B.10
FPGA.BUS5: SCU_FPGA_H_B.12
FPGA.BUS6: SCU_FPGA_H_B.14
FPGA.BUS7: SCU_FPGA_H_B.16
FPGA.BUS8: SCU_FPGA_H_B.18
FPGA.BUS9: SCU_FPGA_H_B.20
FPGA.BUS10: SCU_FPGA_H_B.22
FPGA.BUS11: SCU_FPGA_H_B.24
FPGA.BUS12: SCU_FPGA_H_B.26
FPGA.BUS13: SCU_FPGA_H_B.28
FPGA.BUS14: SCU_FPGA_H_B.30
FPGA.BUS15: SCU_FPGA_H_B.32
FPGA.ENABLE: SCU_FPGA_H_B.36
FPGA.LBUB: SCU_FPGA_H_A.40
FPGA.PROCEN: SCU_FPGA_H_C.2
FPGA.STATE0: SCU_FPGA_H_B.38
FPGA.STATE1: SCU_FPGA_H_B.40
FPGA.WRITE: SCU_FPGA_H_B.34
H_BTN0: SCU.E4(PB0) SCU_SW_H.1
H_BTN1: SCU.F1(PB1) SCU_SW_H.3
H_BTN2: SCU.F2(PB2) SCU_SW_H.5
H_BTN3: SCU.F3(PB3) SCU_SW_H.7
H_BTN4: SCU.F4(PB4) SCU_SW_H.9
H_BTN5: SCU.G1(PB5) SCU_SW_H.11
H_BTN6: SCU.G2(PB6) SCU_SW_H.13
H_BTN7: SCU.K1(PB7) SCU_SW_H.15
H_FPGA_ADDR0: SCU.H1(PC0) SCU_FPGA_H_A.1
H_FPGA_ADDR1: SCU.J1(PC1) SCU_FPGA_H_A.3
H_FPGA_ADDR2: SCU.H2(PC2) SCU_FPGA_H_A.5
H_FPGA_ADDR3: SCU.J2(PC3) SCU_FPGA_H_A.7
H_FPGA_ADDR4: SCU.K2(PC4) SCU_FPGA_H_A.9
H_FPGA_ADDR5: SCU.L2(PC5) SCU_FPGA_H_A.11
H_FPGA_ADDR6: SCU.G10(PC6) SCU_FPGA_H_A.13
H_FPGA_ADDR7: SCU.G11(PC7) SCU_FPGA_H_A.15
H_FPGA_ADDR8: SCU.D10(PC8) SCU_FPGA_H_A.17
H_FPGA_ADDR9: SCU.D11(PC9) SCU_FPGA_H_A.19
H_FPGA_ADDR10: SCU.C10(PC10) SCU_FPGA_H_A.21
H_FPGA_ADDR11: SCU.C11(PC11) SCU_FPGA_H_A.23
H_FPGA_ADDR12: SCU.E9(PE0) SCU_FPGA_H_A.25
H_FPGA_ADDR13: SCU.E10(PE1) SCU_FPGA_H_A.27
H_FPGA_ADDR14: SCU.F10(PE2) SCU_FPGA_H_A.29
H_FPGA_ADDR15: SCU.E11(PE3) SCU_FPGA_H_A.31
H_FPGA_ADDR16: SCU.A9(PE4) SCU_FPGA_H_A.33
H_FPGA_ADDR17: SCU.B9(PE5) SCU_FPGA_H_A.35
H_FPGA_ADDR18: SCU.C9(PE6) SCU_FPGA_H_A.37
H_FPGA_BUS0: SCU.C2(PA0) SCU_FPGA_H_B.1
H_FPGA_BUS1: SCU.C1(PA1) SCU_FPGA_H_B.3
H_FPGA_BUS2: SCU.D2(PA2) SCU_FPGA_H_B.5
H_FPGA_BUS3: SCU.D1(PA3) SCU_FPGA_H_B.7
H_FPGA_BUS4: SCU.E3(PA4) SCU_FPGA_H_B.9
H_FPGA_BUS5: SCU.E2(PA5) SCU_FPGA_H_B.11
H_FPGA_BUS6: SCU.E1(PA6) SCU_FPGA_H_B.13
H_FPGA_BUS7: SCU.H4(PA7) SCU_FPGA_H_B.15
H_FPGA_BUS8: SCU.H5(PA8) SCU_FPGA_H_B.17
H_FPGA_BUS9: SCU.J5(PA9) SCU_FPGA_H_B.19
H_FPGA_BUS10: SCU.J6(PA10) SCU_FPGA_H_B.21
H_FPGA_BUS11: SCU.K5(PA11) SCU_FPGA_H_B.23
H_FPGA_BUS12: SCU.J4(PA12) SCU_FPGA_H_B.25
H_FPGA_BUS13: SCU.K3(PA13) SCU_FPGA_H_B.27
H_FPGA_BUS14: SCU.L3(PA14) SCU_FPGA_H_B.29
H_FPGA_BUS15: SCU.B1(PA15) SCU_FPGA_H_B.31
H_FPGA_ENABLE: SCU.A4(PE9) SCU_FPGA_H_B.35
H_FPGA_LBUB: SCU.D9(PE7) SCU_FPGA_H_A.39
H_FPGA_PROCEN: SCU.J3(PD15) SCU_FPGA_H_C.1
H_FPGA_STATE_0: SCU.C4(PD13) SCU_FPGA_H_B.37
H_FPGA_STATE_1: SCU.H3(PD14) SCU_FPGA_H_B.39
H_FPGA_WRITE: SCU.B4(PE8) SCU_FPGA_H_B.33
H_LED0: SCU.L1(PB8) SCU_LED_H.1
H_LED1: SCU.L5(PB11) SCU_LED_H.3
H_LED2: SCU.L6(PB12) SCU_LED_H.5
H_LED3: SCU.D3(PB15) SCU_LED_H.7
H_LED4: SCU.L11(PD0) SCU_LED_H.9
H_LED5: SCU.J9(PD2) SCU_LED_H.11
H_LED6: SCU.J10(PD3) SCU_LED_H.13
H_LED7: SCU.J11(PD4) SCU_LED_H.15
H_LED8: SCU.H9(PD5) SCU_LED_H.17
H_LED9: SCU.H10(PD6) SCU_LED_H.19
H_LED10: SCU.H11(PD7) SCU_LED_H.21
H_LED11: SCU.H8(PD8) SCU_LED_H.23
H_LED12: SCU.D6(PD9) SCU_LED_H.25
H_LED13: SCU.A5(PD10) SCU_LED_H.27
H_LED14: SCU.B5(PD11) SCU_LED_H.29
H_LED15: SCU.C5(PD12) SCU_LED_H.31
H_SD_CLK: SCU.B2(PE13) SCU_SD_H.3
H_SD_CS: SCU.A3(PE12) SCU_SD_H.1
H_SD_DI: SCU.A1(PE15) SCU_SD_H.7
H_SD_DO: SCU.A2(PE14) SCU_SD_H.5
H_USB_DM: SCU.A10(PF10) SCU_USB_H.3
H_USB_DP: SCU.A11(PF11) SCU_USB_H.5
H_USB_ID: SCU.A8(PF12) SCU_USB_H.7
H_USB_VBUS_ENABLE: SCU.A7(PF5) SCU_USB_H.1
HEADER.DBG_SWCLK: SCU.E8(PF0)
HEADER.DBG_SWDIO: SCU.D8(PF1)
HEADER.DBG_SWO: SCU.C8(PF2)
HEADER.USB_DM_PULLUP: SCU.K11(PD1)
HFXTAL.N: SCU.L9(PB14)
HFXTAL.P: SCU.L8(PB13)
LED0: SCU_LED_H.2
LED1: SCU_LED_H.4
LED2: SCU_LED_H.6
LED3: SCU_LED_H.8
LED4: SCU_LED_H.10
LED5: SCU_LED_H.12
LED6: SCU_LED_H.14
LED7: SCU_LED_H.16
LED8: SCU_LED_H.18
LED9: SCU_LED_H.20
LED10: SCU_LED_H.22
LED11: SCU_LED_H.24
LED12: SCU_LED_H.26
LED13: SCU_LED_H.28
LED14: SCU_LED_H.30
LED15: SCU_LED_H.32
RESETn: SCU.K6(RESETn) ; sheet U_microcontroller_reset_button/RESETn
SD.CLK: SCU_SD_H.4
SD.CS: SCU_SD_H.2
SD.DI: SCU_SD_H.8
SD.DO: SCU_SD_H.6
SW0: SCU_SW_H.2
SW1: SCU_SW_H.4
SW2: SCU_SW_H.6
SW3: SCU_SW_H.8
SW4: SCU_SW_H.10
SW5: SCU_SW_H.12
SW6: SCU_SW_H.14
SW7: SCU_SW_H.16
UART0.CTRL_RX: SCU.C6(PF9)
UART0.CTRL_TX: SCU.B6(PF8)
UART0.RX: SCU.A6(PF7)
UART0.TX: SCU.B7(PF6)
UART1.RX: SCU.J8(PB10)
UART1.TX: SCU.J7(PB9)
USB.DM: SCU_USB_H.4
USB.DP: SCU_USB_H.6
USB.VBUS_ENABLE: SCU_USB_H.2
NetC16_1: C16.1 SCU.F11(DECOUPLE)
NetC17_1: C17.1 SCU.B10(USB_VREGI)
NetC18_1: C18.1 SCU.B8(USB_VBUS)
NetC19_1: C19.1 SCU.B11(USB_VREGO)

### Buses and harness runs
bus LED[0..15] = port LED[0..15]
bus SW[0..7] = port SW[0..7]
harness BOOT = port BOOT
harness FPGA = port FPGA
harness HEADER = port HEADER
harness HFXTAL = port HFXTAL
harness SD = port SD
harness UART0 = port UART0
harness UART1 = port UART1
harness USB = port USB

### Notes on the sheet
- SCU
- 407fdd40
- Labels drawn without touching a wire or pin: USB.ID

### Library data of the parts
C16 C18 C19 = CMP-1038-00005-1: CAP 1uF 100V ±0.25pF 1210 (3225 Metric) Thickness 1mm SMD; Case-Metric: 3225; Case-EIA: 1210; Max Thickness: 1 mm; Rated Voltage: 100 V; Technology: SMT; Tolerance: ±0.25pF
C17 = CMP-1038-00005-1: CAP 4.7uF 100V ±0.25pF 1210 (3225 Metric) Thickness 1mm SMD; Case-Metric: 3225; Case-EIA: 1210; Max Thickness: 1 mm; Rated Voltage: 100 V; Technology: SMT; Tolerance: ±0.25pF
SCU = CMP-0270-00014-1: EFM32 Giant Gecko, M3 ARM Cortex CPU, 1024 KB Flash, 128 KB RAM, 1.85 - 3.8 V Supply, 48 MHz Max Speed, -40 to 85 degC, 112-Pin BGA, RoHS Compliant; LESENSE: Y; Max Speed (MHz): 48; Flash (KB): 1024; GPIO: 87; OPAMPS: 3; RAM (KB): 128; PackageDescription: 112-Pin Ball Grid Array, Body 10 x 10 mm, Pitch 0.8 mm; PartNumber: EFM32GG390F1024-BGA112; USB: Y; PackageReference: BGA112; PackageVersion: Rev. 97SPP01315A_X03_06Jun11; ComponentLink3Description: Package Specification; ComponentLink2Description: Datasheet; ComponentLink1URL: http://www.energymicro.com/; Generic Part Number: EFM32GG390; ARM Cortex CPU: M3; Subcategory: EFM32 Giant Gecko; DatasheetVersion: Rev 1.00; ComponentLink2URL: http://cdn.energymicro.com/dl/devices/pdf/d0040_efm32gg390_datasheet.pdf; Mounting Technology: Surface Mount; ComponentLink3URL: http://cdn.energymicro.com/dl/devices/pdf/d0007_efm32g290_datasheet.pdf; ComponentLink1Description: Manufacturer URL; Supply Voltage (V): 1.85 - 3.8
SCU_FPGA_H_A SCU_FPGA_H_B = Header 20X2: Header, 20-Pin, Dual row; LatestRevisionDate: 17-Jul-2002; LatestRevisionNote: Re-released for DXP Platform.; Publisher: Altium Limited
SCU_FPGA_H_C = Header 2: Header, 2-Pin; LatestRevisionDate: 17-Jul-2002; LatestRevisionNote: Re-released for DXP Platform.; Publisher: Altium Limited
SCU_LED_H = Header 16X2: Header, 16-Pin, Dual row; LatestRevisionDate: 17-Jul-2002; LatestRevisionNote: Re-released for DXP Platform.; Publisher: Altium Limited
SCU_SD_H SCU_USB_H = Header 4X2: Header, 4-Pin, Dual row; LatestRevisionDate: 17-Jul-2002; LatestRevisionNote: Re-released for DXP Platform.; Publisher: Altium Limited
SCU_SW_H = Header 8X2: Header, 8-Pin, Dual row; LatestRevisionDate: 17-Jul-2002; LatestRevisionNote: Re-released for DXP Platform.; Publisher: Altium Limited

## Sheet microcontroller_reset_button.schdoc
size A4
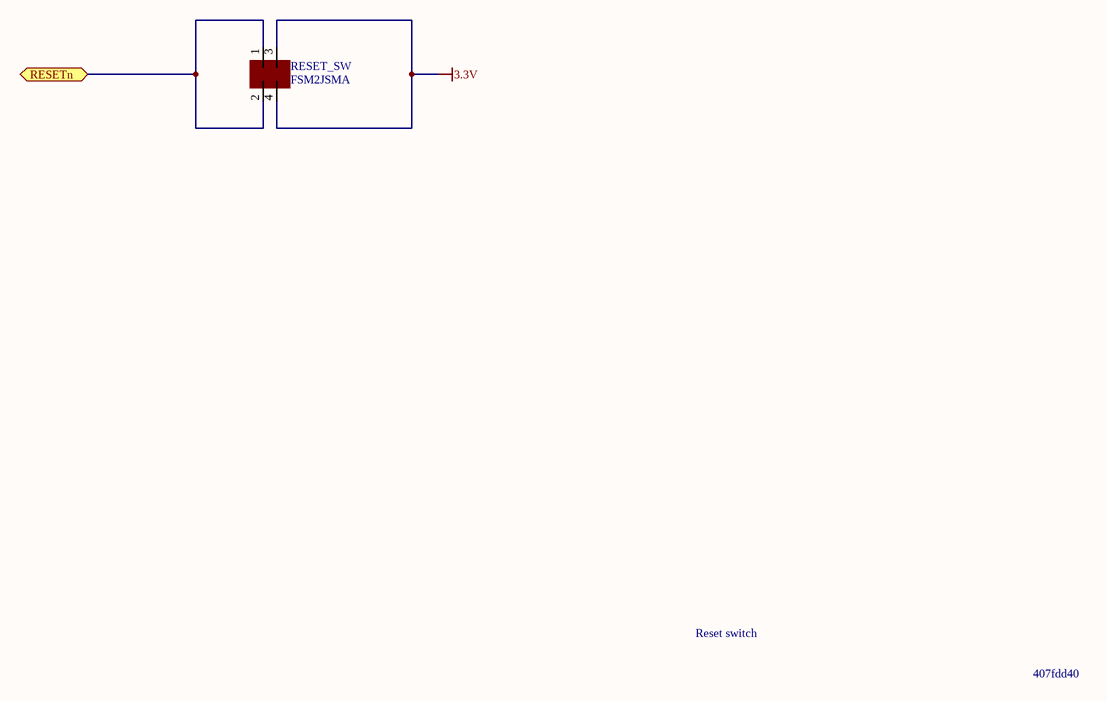
[diagram p8: microcontroller_reset_button.schdoc]

### Parts
RESET_SW  FSM2JSMA  [Button]

### Ports
RESETn

### Nets
3.3V: RESET_SW.3 RESET_SW.4
RESETn: RESET_SW.1 RESET_SW.2 ; port RESETn

### Notes on the sheet
- Reset switch
- 407fdd40

### Library data of the parts
RESET_SW = switch-button

## Sheet FPGA.SchDoc
size A3
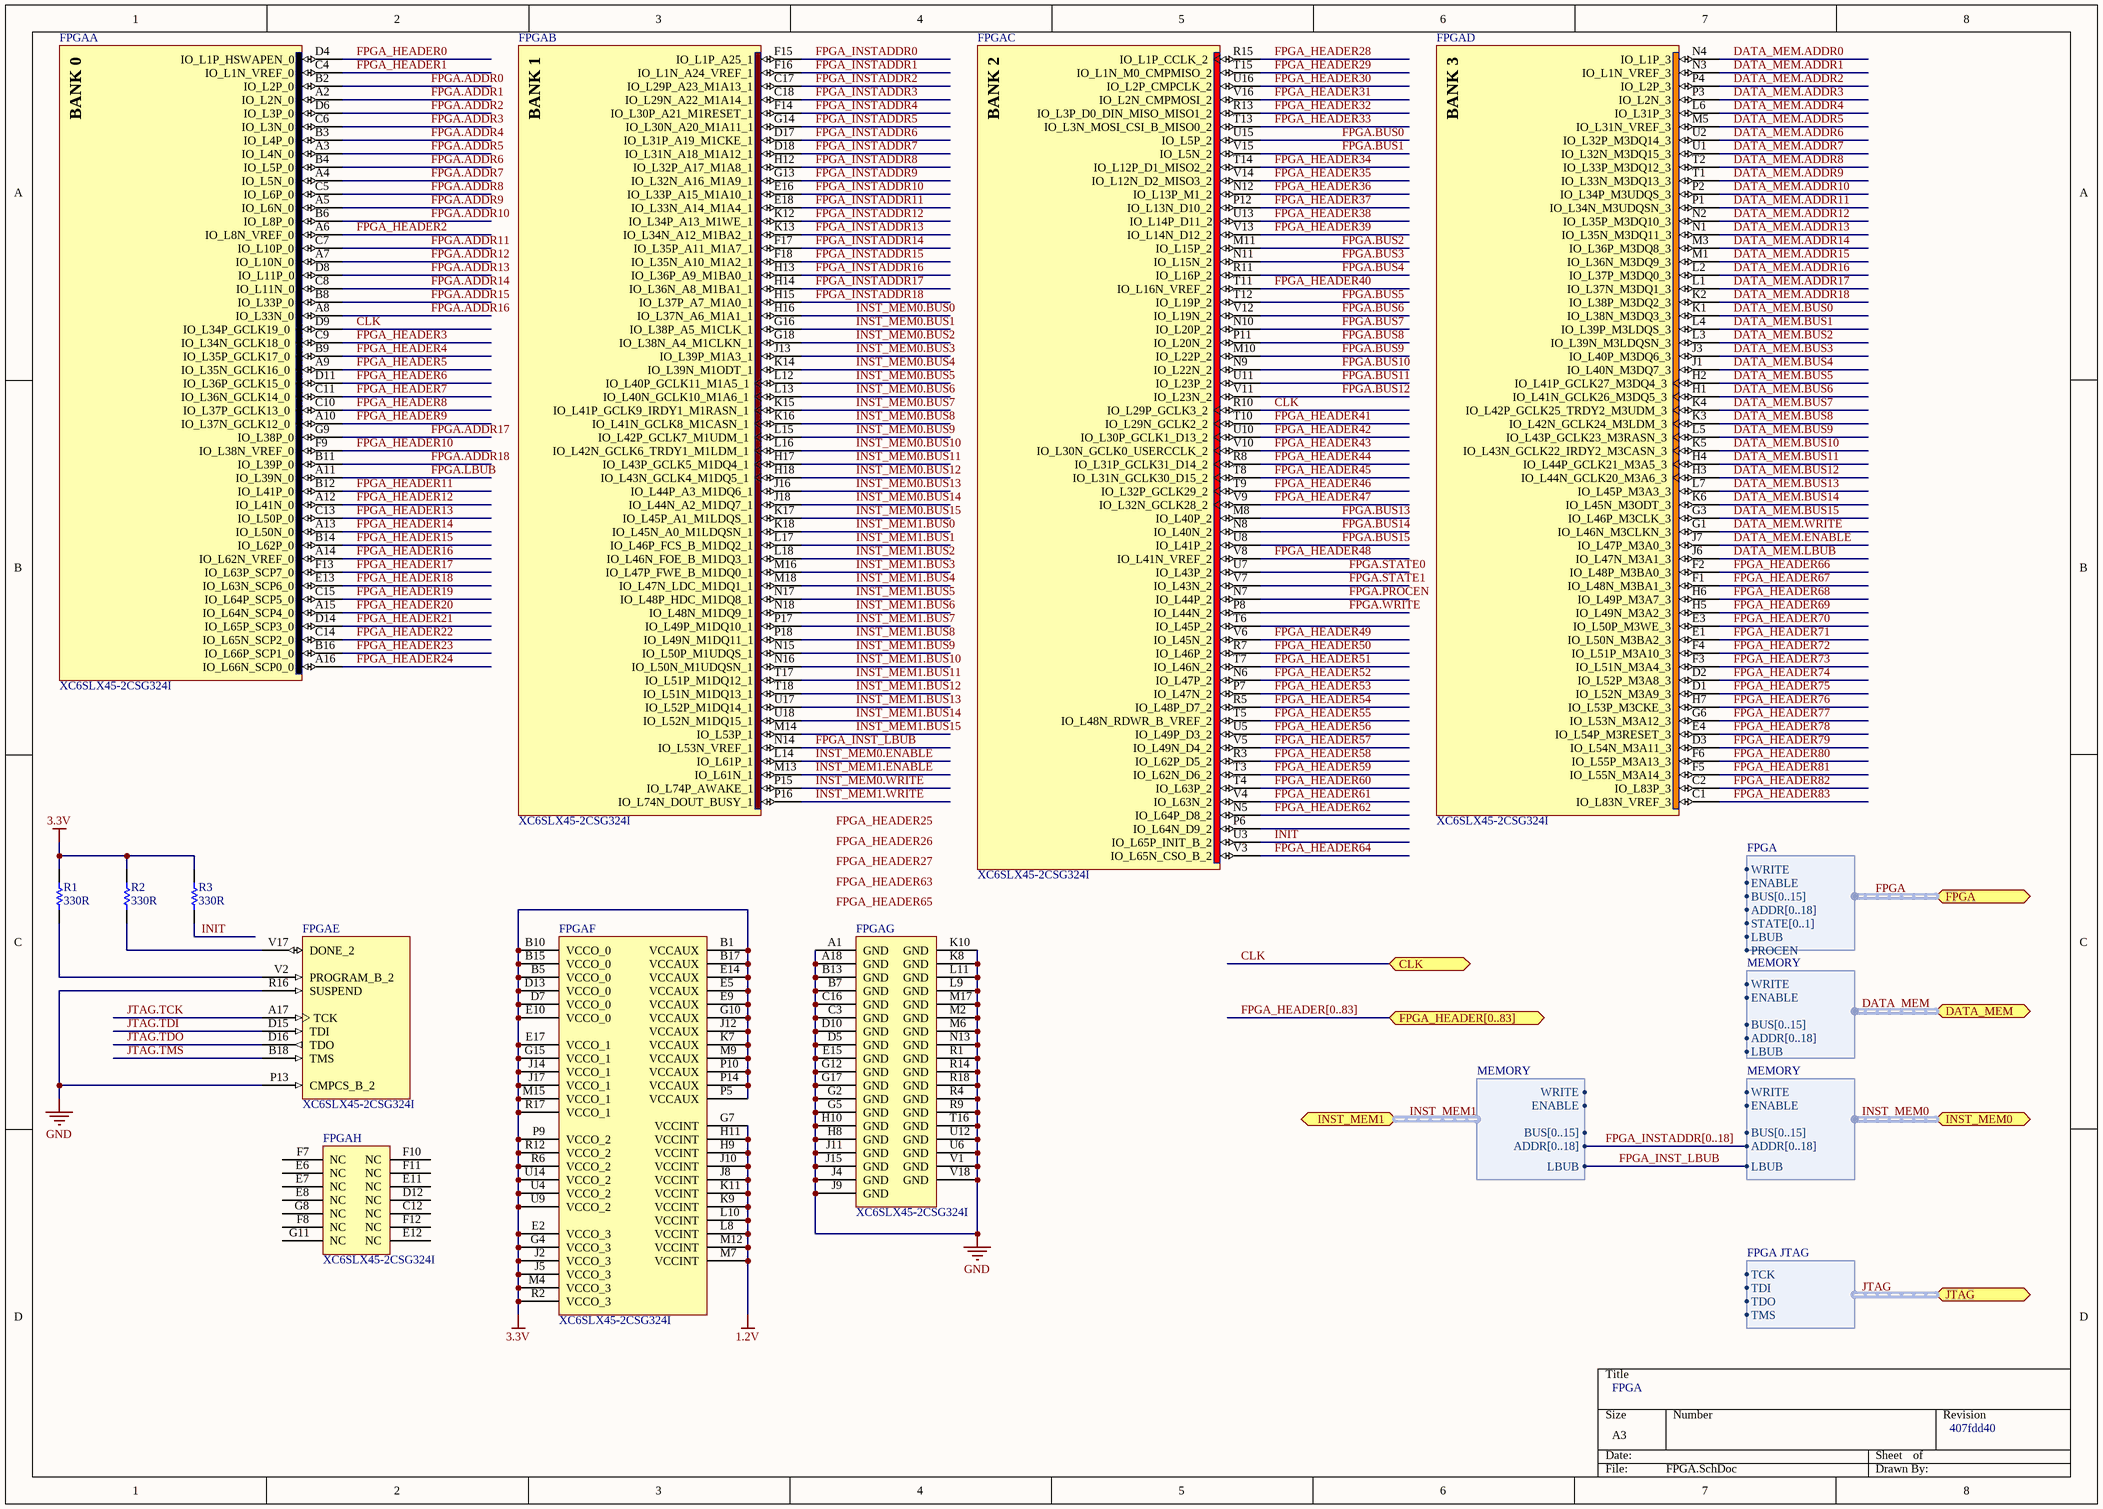
[diagram p9: FPGA.SchDoc]

### Parts
FPGA  XC6SLX45-2CSG324I  [CSG324]  (parts A,B,C,D,E,F,G,H of 8)
R1  value 330R  [RESC1206(3216)_M]  (hidden comment: 330R 5% 1206(3216))
R2  value 330R  [RESC1206(3216)_M]  (hidden comment: 330R 5% 1206(3216))
R3  value 330R  [RESC1206(3216)_M]  (hidden comment: 330R 5% 1206(3216))

### Ports
CLK (bidir), DATA_MEM (harness MEMORY), FPGA (harness FPGA), FPGA_HEADER[0..83] (bidir), INST_MEM0 (harness MEMORY), INST_MEM1 (harness MEMORY), JTAG (harness FPGA JTAG)

### Harnesses
FPGA JTAG: TCK, TDI, TMS, TDO
MEMORY: WRITE, ENABLE, ADDR[0..18], BUS[0..15], LBUB
FPGA: WRITE, ENABLE, ADDR[0..18], STATE[0..1], BUS[0..15], LBUB, PROCEN

### Nets
1.2V: FPGA.G7(VCCINT) FPGA.H9(VCCINT) FPGA.H11(VCCINT) FPGA.J8(VCCINT) FPGA.J10(VCCINT) FPGA.K9(VCCINT) FPGA.K11(VCCINT) FPGA.L8(VCCINT) FPGA.L10(VCCINT) FPGA.M7(VCCINT) FPGA.M12(VCCINT)
3.3V: FPGA.B1(VCCAUX) FPGA.B5(VCCO_0) FPGA.B10(VCCO_0) FPGA.B15(VCCO_0) FPGA.B17(VCCAUX) FPGA.D7(VCCO_0) FPGA.D13(VCCO_0) FPGA.E2(VCCO_3) FPGA.E5(VCCAUX) FPGA.E9(VCCAUX) FPGA.E10(VCCO_0) FPGA.E14(VCCAUX) FPGA.E17(VCCO_1) FPGA.G4(VCCO_3) FPGA.G10(VCCAUX) FPGA.G15(VCCO_1) FPGA.J2(VCCO_3) FPGA.J5(VCCO_3) FPGA.J12(VCCAUX) FPGA.J14(VCCO_1) FPGA.J17(VCCO_1) FPGA.K7(VCCAUX) FPGA.M4(VCCO_3) FPGA.M9(VCCAUX) FPGA.M15(VCCO_1) FPGA.P5(VCCAUX) FPGA.P9(VCCO_2) FPGA.P10(VCCAUX) FPGA.P14(VCCAUX) FPGA.R2(VCCO_3) FPGA.R6(VCCO_2) FPGA.R12(VCCO_2) FPGA.R17(VCCO_1) FPGA.U4(VCCO_2) FPGA.U9(VCCO_2) FPGA.U14(VCCO_2) R1.2 R2.2 R3.2
GND: FPGA.A1(GND) FPGA.A18(GND) FPGA.B7(GND) FPGA.B13(GND) FPGA.C3(GND) FPGA.C16(GND) FPGA.D5(GND) FPGA.D10(GND) FPGA.E15(GND) FPGA.G2(GND) FPGA.G5(GND) FPGA.G12(GND) FPGA.G17(GND) FPGA.H8(GND) FPGA.H10(GND) FPGA.J4(GND) FPGA.J9(GND) FPGA.J11(GND) FPGA.J15(GND) FPGA.K8(GND) FPGA.K10(GND) FPGA.L9(GND) FPGA.L11(GND) FPGA.M2(GND) FPGA.M6(GND) FPGA.M17(GND) FPGA.N13(GND) FPGA.P13(CMPCS_B_2) FPGA.R1(GND) FPGA.R4(GND) FPGA.R9(GND) FPGA.R14(GND) FPGA.R16(SUSPEND) FPGA.R18(GND) FPGA.T16(GND) FPGA.U6(GND) FPGA.U12(GND) FPGA.V1(GND) FPGA.V18(GND)
CLK: FPGA.D9(IO_L34P_GCLK19_0) FPGA.R10(IO_L29P_GCLK3_2) ; port CLK
DATA_MEM.ADDR0: FPGA.N4(IO_L1P_3)
DATA_MEM.ADDR1: FPGA.N3(IO_L1N_VREF_3)
DATA_MEM.ADDR2: FPGA.P4(IO_L2P_3)
DATA_MEM.ADDR3: FPGA.P3(IO_L2N_3)
DATA_MEM.ADDR4: FPGA.L6(IO_L31P_3)
DATA_MEM.ADDR5: FPGA.M5(IO_L31N_VREF_3)
DATA_MEM.ADDR6: FPGA.U2(IO_L32P_M3DQ14_3)
DATA_MEM.ADDR7: FPGA.U1(IO_L32N_M3DQ15_3)
DATA_MEM.ADDR8: FPGA.T2(IO_L33P_M3DQ12_3)
DATA_MEM.ADDR9: FPGA.T1(IO_L33N_M3DQ13_3)
DATA_MEM.ADDR10: FPGA.P2(IO_L34P_M3UDQS_3)
DATA_MEM.ADDR11: FPGA.P1(IO_L34N_M3UDQSN_3)
DATA_MEM.ADDR12: FPGA.N2(IO_L35P_M3DQ10_3)
DATA_MEM.ADDR13: FPGA.N1(IO_L35N_M3DQ11_3)
DATA_MEM.ADDR14: FPGA.M3(IO_L36P_M3DQ8_3)
DATA_MEM.ADDR15: FPGA.M1(IO_L36N_M3DQ9_3)
DATA_MEM.ADDR16: FPGA.L2(IO_L37P_M3DQ0_3)
DATA_MEM.ADDR17: FPGA.L1(IO_L37N_M3DQ1_3)
DATA_MEM.ADDR18: FPGA.K2(IO_L38P_M3DQ2_3)
DATA_MEM.BUS0: FPGA.K1(IO_L38N_M3DQ3_3)
DATA_MEM.BUS1: FPGA.L4(IO_L39P_M3LDQS_3)
DATA_MEM.BUS2: FPGA.L3(IO_L39N_M3LDQSN_3)
DATA_MEM.BUS3: FPGA.J3(IO_L40P_M3DQ6_3)
DATA_MEM.BUS4: FPGA.J1(IO_L40N_M3DQ7_3)
DATA_MEM.BUS5: FPGA.H2(IO_L41P_GCLK27_M3DQ4_3)
DATA_MEM.BUS6: FPGA.H1(IO_L41N_GCLK26_M3DQ5_3)
DATA_MEM.BUS7: FPGA.K4(IO_L42P_GCLK25_TRDY2_M3UDM_3)
DATA_MEM.BUS8: FPGA.K3(IO_L42N_GCLK24_M3LDM_3)
DATA_MEM.BUS9: FPGA.L5(IO_L43P_GCLK23_M3RASN_3)
DATA_MEM.BUS10: FPGA.K5(IO_L43N_GCLK22_IRDY2_M3CASN_3)
DATA_MEM.BUS11: FPGA.H4(IO_L44P_GCLK21_M3A5_3)
DATA_MEM.BUS12: FPGA.H3(IO_L44N_GCLK20_M3A6_3)
DATA_MEM.BUS13: FPGA.L7(IO_L45P_M3A3_3)
DATA_MEM.BUS14: FPGA.K6(IO_L45N_M3ODT_3)
DATA_MEM.BUS15: FPGA.G3(IO_L46P_M3CLK_3)
DATA_MEM.ENABLE: FPGA.J7(IO_L47P_M3A0_3)
DATA_MEM.LBUB: FPGA.J6(IO_L47N_M3A1_3)
DATA_MEM.WRITE: FPGA.G1(IO_L46N_M3CLKN_3)
FPGA.ADDR0: FPGA.B2(IO_L2P_0)
FPGA.ADDR1: FPGA.A2(IO_L2N_0)
FPGA.ADDR2: FPGA.D6(IO_L3P_0)
FPGA.ADDR3: FPGA.C6(IO_L3N_0)
FPGA.ADDR4: FPGA.B3(IO_L4P_0)
FPGA.ADDR5: FPGA.A3(IO_L4N_0)
FPGA.ADDR6: FPGA.B4(IO_L5P_0)
FPGA.ADDR7: FPGA.A4(IO_L5N_0)
FPGA.ADDR8: FPGA.C5(IO_L6P_0)
FPGA.ADDR9: FPGA.A5(IO_L6N_0)
FPGA.ADDR10: FPGA.B6(IO_L8P_0)
FPGA.ADDR11: FPGA.C7(IO_L10P_0)
FPGA.ADDR12: FPGA.A7(IO_L10N_0)
FPGA.ADDR13: FPGA.D8(IO_L11P_0)
FPGA.ADDR14: FPGA.C8(IO_L11N_0)
FPGA.ADDR15: FPGA.B8(IO_L33P_0)
FPGA.ADDR16: FPGA.A8(IO_L33N_0)
FPGA.ADDR17: FPGA.G9(IO_L38P_0)
FPGA.ADDR18: FPGA.B11(IO_L39P_0)
FPGA.BUS0: FPGA.U15(IO_L5P_2)
FPGA.BUS1: FPGA.V15(IO_L5N_2)
FPGA.BUS2: FPGA.M11(IO_L15P_2)
FPGA.BUS3: FPGA.N11(IO_L15N_2)
FPGA.BUS4: FPGA.R11(IO_L16P_2)
FPGA.BUS5: FPGA.T12(IO_L19P_2)
FPGA.BUS6: FPGA.V12(IO_L19N_2)
FPGA.BUS7: FPGA.N10(IO_L20P_2)
FPGA.BUS8: FPGA.P11(IO_L20N_2)
FPGA.BUS9: FPGA.M10(IO_L22P_2)
FPGA.BUS10: FPGA.N9(IO_L22N_2)
FPGA.BUS11: FPGA.U11(IO_L23P_2)
FPGA.BUS12: FPGA.V11(IO_L23N_2)
FPGA.BUS13: FPGA.M8(IO_L40P_2)
FPGA.BUS14: FPGA.N8(IO_L40N_2)
FPGA.BUS15: FPGA.U8(IO_L41P_2)
FPGA.LBUB: FPGA.A11(IO_L39N_0)
FPGA.PROCEN: FPGA.N7(IO_L44P_2)
FPGA.STATE0: FPGA.U7(IO_L43P_2)
FPGA.STATE1: FPGA.V7(IO_L43N_2)
FPGA.WRITE: FPGA.P8(IO_L44N_2)
FPGA_HEADER0: FPGA.D4(IO_L1P_HSWAPEN_0)
FPGA_HEADER1: FPGA.C4(IO_L1N_VREF_0)
FPGA_HEADER2: FPGA.A6(IO_L8N_VREF_0)
FPGA_HEADER3: FPGA.C9(IO_L34N_GCLK18_0)
FPGA_HEADER4: FPGA.B9(IO_L35P_GCLK17_0)
FPGA_HEADER5: FPGA.A9(IO_L35N_GCLK16_0)
FPGA_HEADER6: FPGA.D11(IO_L36P_GCLK15_0)
FPGA_HEADER7: FPGA.C11(IO_L36N_GCLK14_0)
FPGA_HEADER8: FPGA.C10(IO_L37P_GCLK13_0)
FPGA_HEADER9: FPGA.A10(IO_L37N_GCLK12_0)
FPGA_HEADER10: FPGA.F9(IO_L38N_VREF_0)
FPGA_HEADER11: FPGA.B12(IO_L41P_0)
FPGA_HEADER12: FPGA.A12(IO_L41N_0)
FPGA_HEADER13: FPGA.C13(IO_L50P_0)
FPGA_HEADER14: FPGA.A13(IO_L50N_0)
FPGA_HEADER15: FPGA.B14(IO_L62P_0)
FPGA_HEADER16: FPGA.A14(IO_L62N_VREF_0)
FPGA_HEADER17: FPGA.F13(IO_L63P_SCP7_0)
FPGA_HEADER18: FPGA.E13(IO_L63N_SCP6_0)
FPGA_HEADER19: FPGA.C15(IO_L64P_SCP5_0)
FPGA_HEADER20: FPGA.A15(IO_L64N_SCP4_0)
FPGA_HEADER21: FPGA.D14(IO_L65P_SCP3_0)
FPGA_HEADER22: FPGA.C14(IO_L65N_SCP2_0)
FPGA_HEADER23: FPGA.B16(IO_L66P_SCP1_0)
FPGA_HEADER24: FPGA.A16(IO_L66N_SCP0_0)
FPGA_HEADER28: FPGA.R15(IO_L1P_CCLK_2)
FPGA_HEADER29: FPGA.T15(IO_L1N_M0_CMPMISO_2)
FPGA_HEADER30: FPGA.U16(IO_L2P_CMPCLK_2)
FPGA_HEADER31: FPGA.V16(IO_L2N_CMPMOSI_2)
FPGA_HEADER32: FPGA.R13(IO_L3P_D0_DIN_MISO_MISO1_2)
FPGA_HEADER33: FPGA.T13(IO_L3N_MOSI_CSI_B_MISO0_2)
FPGA_HEADER34: FPGA.T14(IO_L12P_D1_MISO2_2)
FPGA_HEADER35: FPGA.V14(IO_L12N_D2_MISO3_2)
FPGA_HEADER36: FPGA.N12(IO_L13P_M1_2)
FPGA_HEADER37: FPGA.P12(IO_L13N_D10_2)
FPGA_HEADER38: FPGA.U13(IO_L14P_D11_2)
FPGA_HEADER39: FPGA.V13(IO_L14N_D12_2)
FPGA_HEADER40: FPGA.T11(IO_L16N_VREF_2)
FPGA_HEADER41: FPGA.T10(IO_L29N_GCLK2_2)
FPGA_HEADER42: FPGA.U10(IO_L30P_GCLK1_D13_2)
FPGA_HEADER43: FPGA.V10(IO_L30N_GCLK0_USERCCLK_2)
FPGA_HEADER44: FPGA.R8(IO_L31P_GCLK31_D14_2)
FPGA_HEADER45: FPGA.T8(IO_L31N_GCLK30_D15_2)
FPGA_HEADER46: FPGA.T9(IO_L32P_GCLK29_2)
FPGA_HEADER47: FPGA.V9(IO_L32N_GCLK28_2)
FPGA_HEADER48: FPGA.V8(IO_L41N_VREF_2)
FPGA_HEADER49: FPGA.V6(IO_L45N_2)
FPGA_HEADER50: FPGA.R7(IO_L46P_2)
FPGA_HEADER51: FPGA.T7(IO_L46N_2)
FPGA_HEADER52: FPGA.N6(IO_L47P_2)
FPGA_HEADER53: FPGA.P7(IO_L47N_2)
FPGA_HEADER54: FPGA.R5(IO_L48P_D7_2)
FPGA_HEADER55: FPGA.T5(IO_L48N_RDWR_B_VREF_2)
FPGA_HEADER56: FPGA.U5(IO_L49P_D3_2)
FPGA_HEADER57: FPGA.V5(IO_L49N_D4_2)
FPGA_HEADER58: FPGA.R3(IO_L62P_D5_2)
FPGA_HEADER59: FPGA.T3(IO_L62N_D6_2)
FPGA_HEADER60: FPGA.T4(IO_L63P_2)
FPGA_HEADER61: FPGA.V4(IO_L63N_2)
FPGA_HEADER62: FPGA.N5(IO_L64P_D8_2)
FPGA_HEADER64: FPGA.V3(IO_L65N_CSO_B_2)
FPGA_HEADER66: FPGA.F2(IO_L48P_M3BA0_3)
FPGA_HEADER67: FPGA.F1(IO_L48N_M3BA1_3)
FPGA_HEADER68: FPGA.H6(IO_L49P_M3A7_3)
FPGA_HEADER69: FPGA.H5(IO_L49N_M3A2_3)
FPGA_HEADER70: FPGA.E3(IO_L50P_M3WE_3)
FPGA_HEADER71: FPGA.E1(IO_L50N_M3BA2_3)
FPGA_HEADER72: FPGA.F4(IO_L51P_M3A10_3)
FPGA_HEADER73: FPGA.F3(IO_L51N_M3A4_3)
FPGA_HEADER74: FPGA.D2(IO_L52P_M3A8_3)
FPGA_HEADER75: FPGA.D1(IO_L52N_M3A9_3)
FPGA_HEADER76: FPGA.H7(IO_L53P_M3CKE_3)
FPGA_HEADER77: FPGA.G6(IO_L53N_M3A12_3)
FPGA_HEADER78: FPGA.E4(IO_L54P_M3RESET_3)
FPGA_HEADER79: FPGA.D3(IO_L54N_M3A11_3)
FPGA_HEADER80: FPGA.F6(IO_L55P_M3A13_3)
FPGA_HEADER81: FPGA.F5(IO_L55N_M3A14_3)
FPGA_HEADER82: FPGA.C2(IO_L83P_3)
FPGA_HEADER83: FPGA.C1(IO_L83N_VREF_3)
FPGA_INST_LBUB: FPGA.N14(IO_L53N_VREF_1) ; port INST_MEM0.LBUB, port INST_MEM1.LBUB
FPGA_INSTADDR0: FPGA.F15(IO_L1P_A25_1)
FPGA_INSTADDR1: FPGA.F16(IO_L1N_A24_VREF_1)
FPGA_INSTADDR2: FPGA.C17(IO_L29P_A23_M1A13_1)
FPGA_INSTADDR3: FPGA.C18(IO_L29N_A22_M1A14_1)
FPGA_INSTADDR4: FPGA.F14(IO_L30P_A21_M1RESET_1)
FPGA_INSTADDR5: FPGA.G14(IO_L30N_A20_M1A11_1)
FPGA_INSTADDR6: FPGA.D17(IO_L31P_A19_M1CKE_1)
FPGA_INSTADDR7: FPGA.D18(IO_L31N_A18_M1A12_1)
FPGA_INSTADDR8: FPGA.H12(IO_L32P_A17_M1A8_1)
FPGA_INSTADDR9: FPGA.G13(IO_L32N_A16_M1A9_1)
FPGA_INSTADDR10: FPGA.E16(IO_L33P_A15_M1A10_1)
FPGA_INSTADDR11: FPGA.E18(IO_L33N_A14_M1A4_1)
FPGA_INSTADDR12: FPGA.K12(IO_L34P_A13_M1WE_1)
FPGA_INSTADDR13: FPGA.K13(IO_L34N_A12_M1BA2_1)
FPGA_INSTADDR14: FPGA.F17(IO_L35P_A11_M1A7_1)
FPGA_INSTADDR15: FPGA.F18(IO_L35N_A10_M1A2_1)
FPGA_INSTADDR16: FPGA.H13(IO_L36P_A9_M1BA0_1)
FPGA_INSTADDR17: FPGA.H14(IO_L36N_A8_M1BA1_1)
FPGA_INSTADDR18: FPGA.H15(IO_L37P_A7_M1A0_1)
INIT: FPGA.U3(IO_L65P_INIT_B_2) R3.1
INST_MEM0.BUS0: FPGA.H16(IO_L37N_A6_M1A1_1)
INST_MEM0.BUS1: FPGA.G16(IO_L38P_A5_M1CLK_1)
INST_MEM0.BUS2: FPGA.G18(IO_L38N_A4_M1CLKN_1)
INST_MEM0.BUS3: FPGA.J13(IO_L39P_M1A3_1)
INST_MEM0.BUS4: FPGA.K14(IO_L39N_M1ODT_1)
INST_MEM0.BUS5: FPGA.L12(IO_L40P_GCLK11_M1A5_1)
INST_MEM0.BUS6: FPGA.L13(IO_L40N_GCLK10_M1A6_1)
INST_MEM0.BUS7: FPGA.K15(IO_L41P_GCLK9_IRDY1_M1RASN_1)
INST_MEM0.BUS8: FPGA.K16(IO_L41N_GCLK8_M1CASN_1)
INST_MEM0.BUS9: FPGA.L15(IO_L42P_GCLK7_M1UDM_1)
INST_MEM0.BUS10: FPGA.L16(IO_L42N_GCLK6_TRDY1_M1LDM_1)
INST_MEM0.BUS11: FPGA.H17(IO_L43P_GCLK5_M1DQ4_1)
INST_MEM0.BUS12: FPGA.H18(IO_L43N_GCLK4_M1DQ5_1)
INST_MEM0.BUS13: FPGA.J16(IO_L44P_A3_M1DQ6_1)
INST_MEM0.BUS14: FPGA.J18(IO_L44N_A2_M1DQ7_1)
INST_MEM0.BUS15: FPGA.K17(IO_L45P_A1_M1LDQS_1)
INST_MEM0.ENABLE: FPGA.L14(IO_L61P_1)
INST_MEM0.WRITE: FPGA.P15(IO_L74P_AWAKE_1)
INST_MEM1.BUS0: FPGA.K18(IO_L45N_A0_M1LDQSN_1)
INST_MEM1.BUS1: FPGA.L17(IO_L46P_FCS_B_M1DQ2_1)
INST_MEM1.BUS2: FPGA.L18(IO_L46N_FOE_B_M1DQ3_1)
INST_MEM1.BUS3: FPGA.M16(IO_L47P_FWE_B_M1DQ0_1)
INST_MEM1.BUS4: FPGA.M18(IO_L47N_LDC_M1DQ1_1)
INST_MEM1.BUS5: FPGA.N17(IO_L48P_HDC_M1DQ8_1)
INST_MEM1.BUS6: FPGA.N18(IO_L48N_M1DQ9_1)
INST_MEM1.BUS7: FPGA.P17(IO_L49P_M1DQ10_1)
INST_MEM1.BUS8: FPGA.P18(IO_L49N_M1DQ11_1)
INST_MEM1.BUS9: FPGA.N15(IO_L50P_M1UDQS_1)
INST_MEM1.BUS10: FPGA.N16(IO_L50N_M1UDQSN_1)
INST_MEM1.BUS11: FPGA.T17(IO_L51P_M1DQ12_1)
INST_MEM1.BUS12: FPGA.T18(IO_L51N_M1DQ13_1)
INST_MEM1.BUS13: FPGA.U17(IO_L52P_M1DQ14_1)
INST_MEM1.BUS14: FPGA.U18(IO_L52N_M1DQ15_1)
INST_MEM1.BUS15: FPGA.M14(IO_L53P_1)
INST_MEM1.ENABLE: FPGA.M13(IO_L61N_1)
INST_MEM1.WRITE: FPGA.P16(IO_L74N_DOUT_BUSY_1)
JTAG.TCK: FPGA.A17(TCK)
JTAG.TDI: FPGA.D15(TDI)
JTAG.TDO: FPGA.D16(TDO)
JTAG.TMS: FPGA.B18(TMS)
NetFPGA_V2: FPGA.V2(PROGRAM_B_2) R1.1
NetFPGA_V17: FPGA.V17(DONE_2) R2.1

Not connected (* = marked no-connect by the designer): FPGA C12(NC) D12(NC) E6(NC) E7(NC) E8(NC) E11(NC) E12(NC) F7(NC) F8(NC) F10(NC) F11(NC) F12(NC) G8(NC) G11(NC) P6(IO_L64N_D9_2) T6(IO_L45P_2)

### Buses and harness runs
bus FPGA_HEADER[0..83] = port FPGA_HEADER[0..83]
bus FPGA_INSTADDR[0..18]
harness DATA_MEM = port DATA_MEM
harness FPGA = port FPGA
harness INST_MEM0 = port INST_MEM0
harness INST_MEM1 = port INST_MEM1
harness JTAG = port JTAG

### Notes on the sheet
- FPGA
- 407fdd40
- Labels drawn without touching a wire or pin: FPGA_HEADER25, FPGA_HEADER26, FPGA_HEADER27, FPGA_HEADER63, FPGA_HEADER65
- (in symbol XC6SLX45-2CSG324I, part A) BANK 0
- (in symbol XC6SLX45-2CSG324I, part B) BANK 1
- (in symbol XC6SLX45-2CSG324I, part C) BANK 2
- (in symbol XC6SLX45-2CSG324I, part D) BANK 3

### Library data of the parts
FPGA = XC6SLX45-2CSG324I: Spartan-6 LX 1.2V FPGA, 218 User I/Os, 324-Ball Chip-Scale BGA (0.8mm Pitch), Speed Grade 2, Industrial Grade, Pb-Free; DatasheetVersion: ver1.6, Nov-2010; PackageVersion: ver1.1, Nov-2009; PackageReference: CSG324; PackageDescription: 324-Ball Chip-Scale BGA (CSG324) Package, 0.8 mm Pitch; Code_JEDEC: MO-275-KKAC-1; ComponentLink1Description: Manufacturer URL; ComponentLink1URL: http://www.xilinx.com/; ComponentLink2Description: Spartan-6 Datasheet; ComponentLink2URL: http://www.xilinx.com/support/documentation/data_sheets/ds160.pdf; ComponentLink3Description: Spartan-6 Documents; ComponentLink3URL: http://www.xilinx.com/support/documentation/spartan-6.htm
R1-R3 = CMP-1014-00062-1: 330R 0.25W 5% 1206 (3216 Metric)  SMD; Case-Metric: 3216; Case-EIA: 1206; Tolerance: 5 %; Technology: SMT; Power: 0.25 W

## Sheet USBdevice.SchDoc
size A4
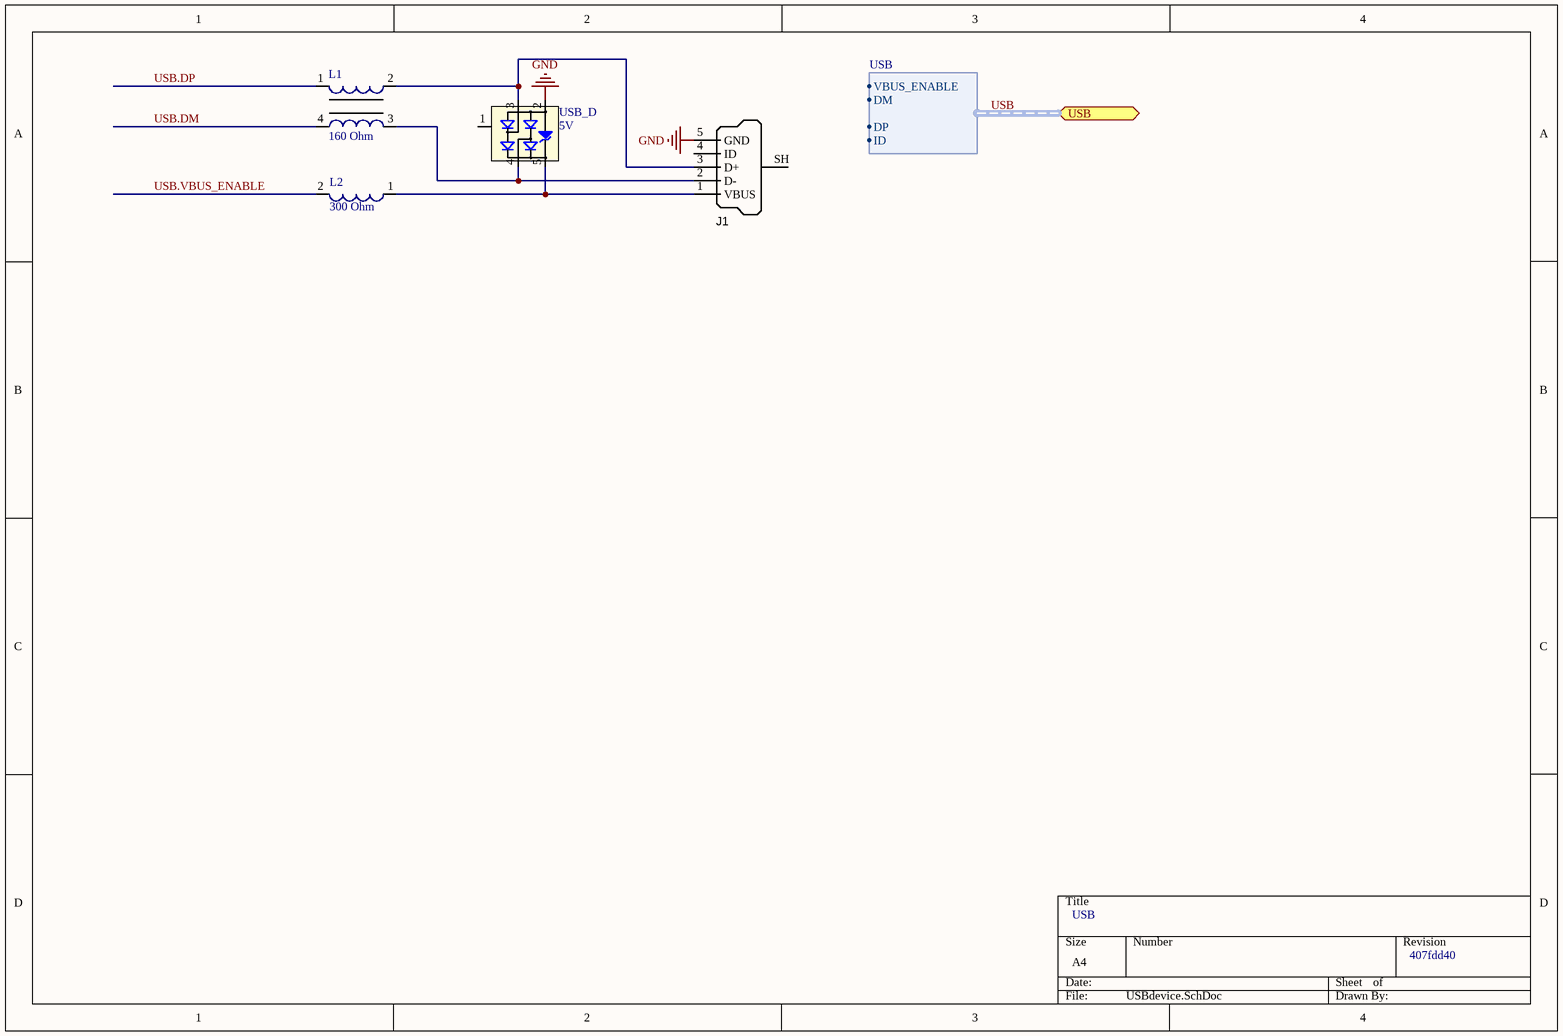
[diagram p10: USBdevice.SchDoc]

### Parts
J1  USB Micro Type B  [USB_Micro-B_FCI_SMD]  (value not drawn)
L1  160 Ohm  [WE-CNSW, 1206]
L2  300 Ohm  [SMD 0603]
USB_D  5V  [SOT23_5L]

### Ports
USB (harness USB)

### Harnesses
USB: VBUS_ENABLE, DM, DP, ID

### Nets
GND: J1.5(GND) USB_D.2(GND)
USB.DM: L1.4
USB.DP: L1.1
USB.VBUS_ENABLE: L2.2
NetJ1_1: J1.1(VBUS) L2.1 USB_D.5(VDD)
NetJ1_2: J1.2(D-) L1.3 USB_D.4(I/O2)
NetJ1_3: J1.3(D+) L1.2 USB_D.3(I/O1)

Not connected (* = marked no-connect by the designer): J1 4(ID) SH(Shell); USB_D 1(NC)

### Buses and harness runs
harness USB = port USB

### Notes on the sheet
- USB
- 407fdd40

### Library data of the parts
J1 = USB_Micro_TypeB_FCI: Connector SMD-THD USB Micro Type B middle mount; Manufacturer 1: FCI; Manufacturer Part Number 1: 10103593-0001LF; Package / Case: SMD/THD mid-mount; Supplier 1: Digi-Key; Supplier Part Number 1: 609-4049-1-ND
L1 = WE-CNSW 1206, 744232161: SMD Common Mode Noise Suppressor WE-CNSW,  Z= 160 Ohm; Manufacturer: Würth Elektronik eiSos GmbH; partNo: 744232161; Impedance: 160 Ohm; ComponentLink1Description: Manufacturer; ComponentLink1URL: http://www.we-online.de; Created by: Christin Zierenner; Created Date: November 2009; ComponentLink2Description: Datasheet; ComponentLink2URL: http://www.we-online.de/katalog/media/pdf/744232161.pdf
L2 = WE-CBF 0603, 742792641: SMD EMI Suppression Ferrite Beads WE-CBF, Z= 300 Ohm; Manufacturer: Würth Elektronik eiSos GmbH; partNo: 742792641; Impedance: 300 Ohm; ComponentLink1Description: Manufacturer; ComponentLink1URL: http://www.we-online.de; Created by: Christin Zierenner; Created Date: May 2009; ComponentLink2Description: Datasheet; ComponentLink2URL: http://www.we-online.de/katalog/media/pdf/742792641.pdf
USB_D = WE-TVS-HS,SOT23-5L,824011: TVS Diode WE-TVS-HS, VRWM=5V; PartNo: 824011; Manufacturer: Würth Elektronik eiSos GmbH; Reverse Stand Off Voltage: 5V; ComponentLink1Description: Manufacturer; ComponentLink1URL: http://www.we-online.de; Created by: Christin Zierenner; Created Date: March 2010; ComponentLink2Description: Datasheet; ComponentLink2URL: http://katalog.we-online.de/kataloge/eisos/media/pdf/824011.pdf

## Sheet sdsheet.SchDoc
size A4
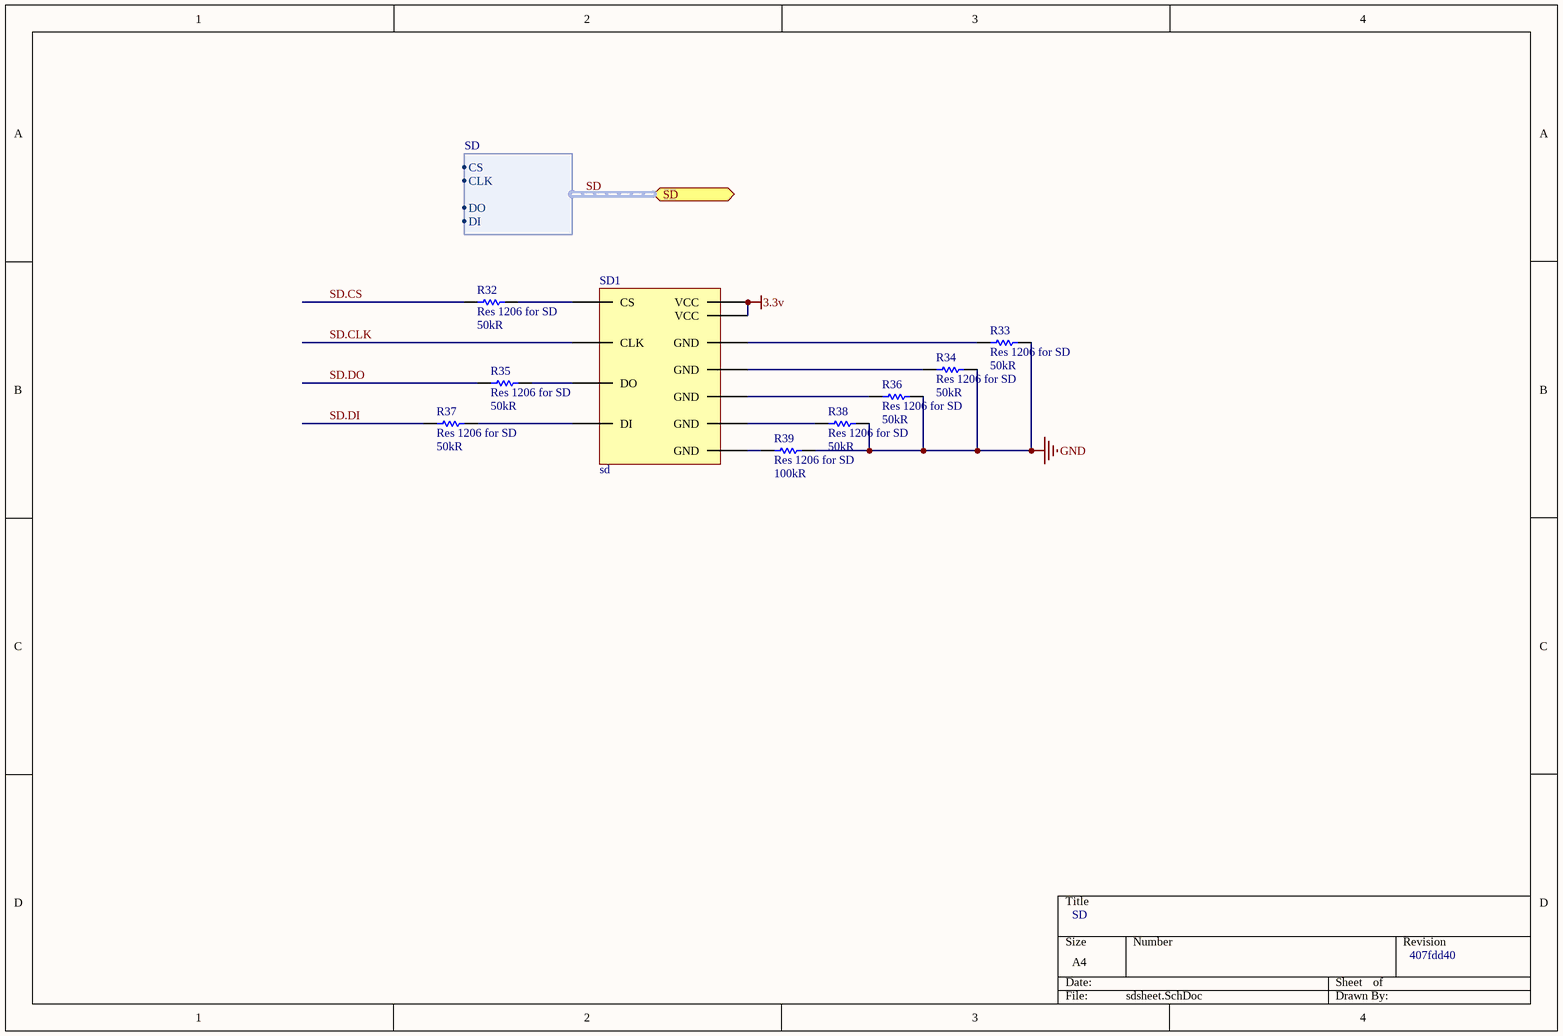
[diagram p11: sdsheet.SchDoc]

### Parts
R32  Res 1206 for SD  value 50kR  [RESC1206(3216)_M]
R33  Res 1206 for SD  value 50kR  [RESC1206(3216)_M]
R34  Res 1206 for SD  value 50kR  [RESC1206(3216)_M]
R35  Res 1206 for SD  value 50kR  [RESC1206(3216)_M]
R36  Res 1206 for SD  value 50kR  [RESC1206(3216)_M]
R37  Res 1206 for SD  value 50kR  [RESC1206(3216)_M]
R38  Res 1206 for SD  value 50kR  [RESC1206(3216)_M]
R39  Res 1206 for SD  value 100kR  [RESC1206(3216)_L]
SD1  sd  [Edge Connector - duplicate1]

### Ports
SD (harness SD)

### Harnesses
SD: CS, CLK, DO, DI

### Nets
3.3V: SD1.4(VCC) SD1.11(VCC)
GND: R33.2 R34.2 R36.2 R38.2 R39.2
SD.CLK: SD1.5(CLK)
SD.CS: R32.1
SD.DI: R37.1
SD.DO: R35.1
NetR32_2: R32.2 SD1.1(CS)
NetR33_1: R33.1 SD1.3(GND)
NetR34_1: R34.1 SD1.6(GND)
NetR35_2: R35.2 SD1.7(DO)
NetR36_1: R36.1 SD1.8(GND)
NetR37_2: R37.2 SD1.2(DI)
NetR38_1: R38.1 SD1.10(GND)
NetR39_1: R39.1 SD1.12(GND)

### Buses and harness runs
harness SD = port SD

### Notes on the sheet
- SD
- 407fdd40

### Library data of the parts
R32-R38 = CMP-1014-00702-1: 49K9 0.25W 1% 1206 (3216 Metric)  SMD; Case-EIA: 1206; Case-Metric: 3216; Technology: SMT; Tolerance: 1 %; Power: 0.25 W
R39 = CMP-1014-00736-1: 100K 0.25W 1% 1206 (3216 Metric)  SMD; Case-EIA: 1206; Case-Metric: 3216; Tolerance: 1 %; Power: 0.25 W; Technology: SMT

## Sheet headers.SchDoc
size A4
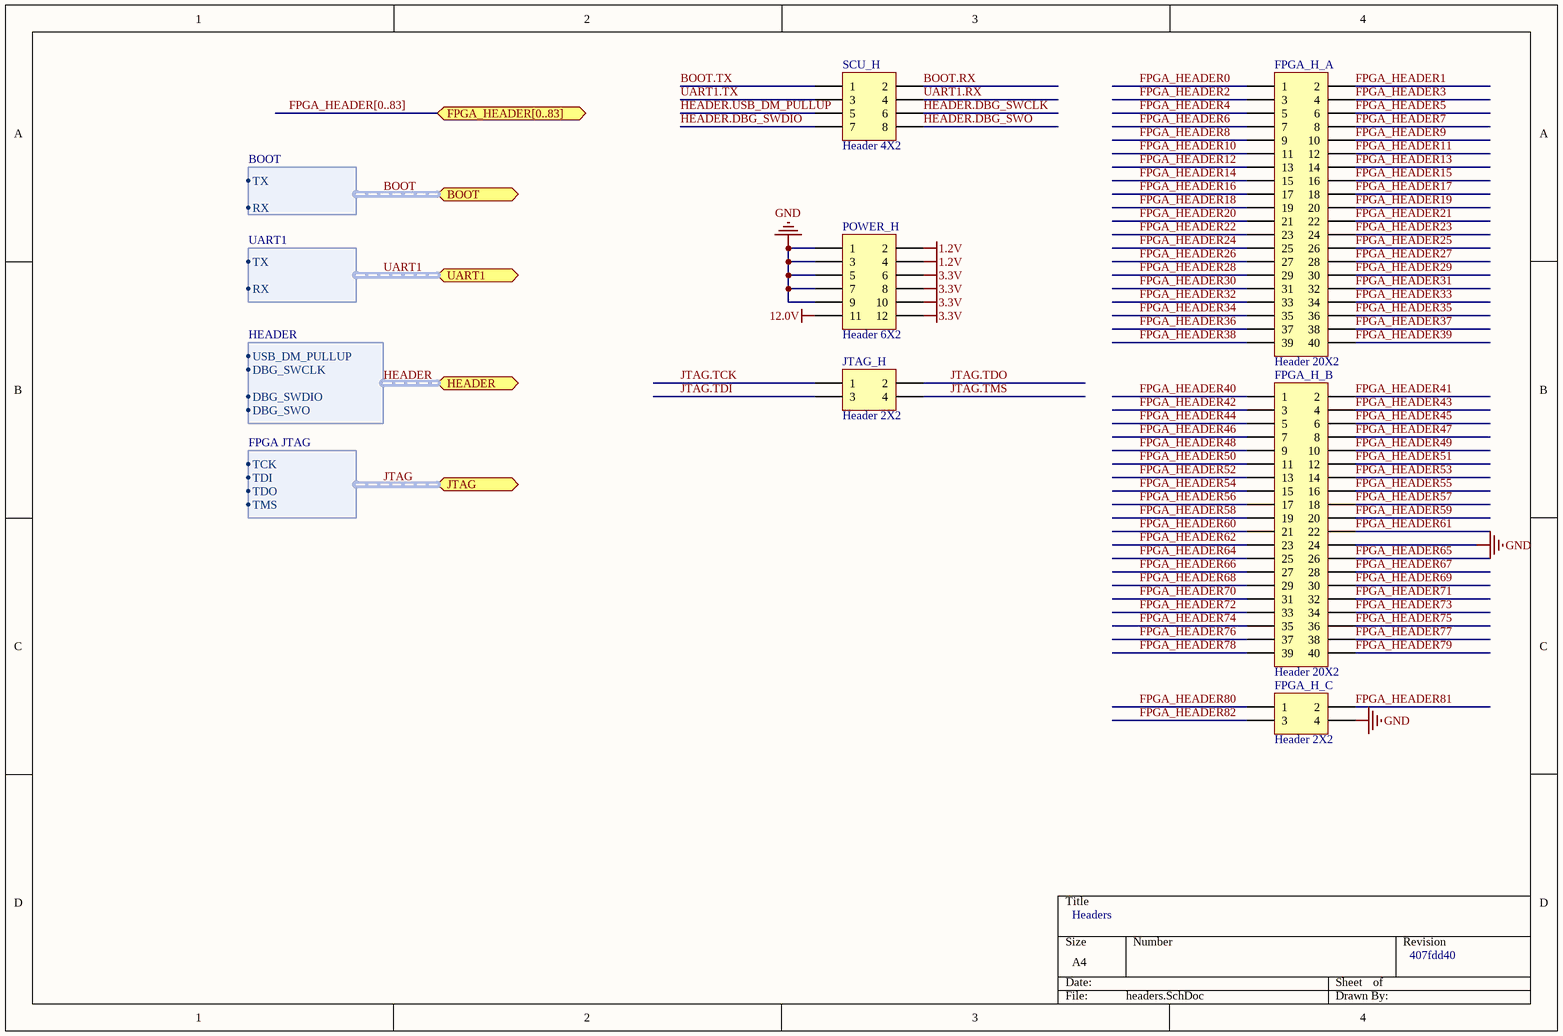
[diagram p12: headers.SchDoc]

### Parts
FPGA_H_A  Header 20X2  [HDR2X20]
FPGA_H_B  Header 20X2  [HDR2X20]
FPGA_H_C  Header 2X2  [HDR2X2]
JTAG_H  Header 2X2  [HDR2X2]
POWER_H  Header 6X2  [HDR2X6]
SCU_H  Header 4X2  [HDR2X4]

### Ports
BOOT (harness BOOT), FPGA_HEADER[0..83] (bidir), HEADER (harness HEADER), JTAG (harness FPGA JTAG), UART1 (harness UART1)

### Harnesses
UART1: TX, RX
BOOT: TX, RX
HEADER: USB_DM_PULLUP, DBG_SWCLK, DBG_SWDIO, DBG_SWO
FPGA JTAG: TCK, TDI, TMS, TDO

### Nets
1.2V: POWER_H.2 POWER_H.4
3.3V: POWER_H.6 POWER_H.8 POWER_H.10 POWER_H.12
12.0V: POWER_H.11
GND: FPGA_H_B.24 FPGA_H_C.4 POWER_H.1 POWER_H.3 POWER_H.5 POWER_H.7 POWER_H.9
BOOT.RX: SCU_H.2
BOOT.TX: SCU_H.1
FPGA_HEADER0: FPGA_H_A.1
FPGA_HEADER1: FPGA_H_A.2
FPGA_HEADER2: FPGA_H_A.3
FPGA_HEADER3: FPGA_H_A.4
FPGA_HEADER4: FPGA_H_A.5
FPGA_HEADER5: FPGA_H_A.6
FPGA_HEADER6: FPGA_H_A.7
FPGA_HEADER7: FPGA_H_A.8
FPGA_HEADER8: FPGA_H_A.9
FPGA_HEADER9: FPGA_H_A.10
FPGA_HEADER10: FPGA_H_A.11
FPGA_HEADER11: FPGA_H_A.12
FPGA_HEADER12: FPGA_H_A.13
FPGA_HEADER13: FPGA_H_A.14
FPGA_HEADER14: FPGA_H_A.15
FPGA_HEADER15: FPGA_H_A.16
FPGA_HEADER16: FPGA_H_A.17
FPGA_HEADER17: FPGA_H_A.18
FPGA_HEADER18: FPGA_H_A.19
FPGA_HEADER19: FPGA_H_A.20
FPGA_HEADER20: FPGA_H_A.21
FPGA_HEADER21: FPGA_H_A.22
FPGA_HEADER22: FPGA_H_A.23
FPGA_HEADER23: FPGA_H_A.24
FPGA_HEADER24: FPGA_H_A.25
FPGA_HEADER25: FPGA_H_A.26
FPGA_HEADER26: FPGA_H_A.27
FPGA_HEADER27: FPGA_H_A.28
FPGA_HEADER28: FPGA_H_A.29
FPGA_HEADER29: FPGA_H_A.30
FPGA_HEADER30: FPGA_H_A.31
FPGA_HEADER31: FPGA_H_A.32
FPGA_HEADER32: FPGA_H_A.33
FPGA_HEADER33: FPGA_H_A.34
FPGA_HEADER34: FPGA_H_A.35
FPGA_HEADER35: FPGA_H_A.36
FPGA_HEADER36: FPGA_H_A.37
FPGA_HEADER37: FPGA_H_A.38
FPGA_HEADER38: FPGA_H_A.39
FPGA_HEADER39: FPGA_H_A.40
FPGA_HEADER40: FPGA_H_B.1
FPGA_HEADER41: FPGA_H_B.2
FPGA_HEADER42: FPGA_H_B.3
FPGA_HEADER43: FPGA_H_B.4
FPGA_HEADER44: FPGA_H_B.5
FPGA_HEADER45: FPGA_H_B.6
FPGA_HEADER46: FPGA_H_B.7
FPGA_HEADER47: FPGA_H_B.8
FPGA_HEADER48: FPGA_H_B.9
FPGA_HEADER49: FPGA_H_B.10
FPGA_HEADER50: FPGA_H_B.11
FPGA_HEADER51: FPGA_H_B.12
FPGA_HEADER52: FPGA_H_B.13
FPGA_HEADER53: FPGA_H_B.14
FPGA_HEADER54: FPGA_H_B.15
FPGA_HEADER55: FPGA_H_B.16
FPGA_HEADER56: FPGA_H_B.17
FPGA_HEADER57: FPGA_H_B.18
FPGA_HEADER58: FPGA_H_B.19
FPGA_HEADER59: FPGA_H_B.20
FPGA_HEADER60: FPGA_H_B.21
FPGA_HEADER61: FPGA_H_B.22
FPGA_HEADER62: FPGA_H_B.23
FPGA_HEADER64: FPGA_H_B.25
FPGA_HEADER65: FPGA_H_B.26
FPGA_HEADER66: FPGA_H_B.27
FPGA_HEADER67: FPGA_H_B.28
FPGA_HEADER68: FPGA_H_B.29
FPGA_HEADER69: FPGA_H_B.30
FPGA_HEADER70: FPGA_H_B.31
FPGA_HEADER71: FPGA_H_B.32
FPGA_HEADER72: FPGA_H_B.33
FPGA_HEADER73: FPGA_H_B.34
FPGA_HEADER74: FPGA_H_B.35
FPGA_HEADER75: FPGA_H_B.36
FPGA_HEADER76: FPGA_H_B.37
FPGA_HEADER77: FPGA_H_B.38
FPGA_HEADER78: FPGA_H_B.39
FPGA_HEADER79: FPGA_H_B.40
FPGA_HEADER80: FPGA_H_C.1
FPGA_HEADER81: FPGA_H_C.2
FPGA_HEADER82: FPGA_H_C.3
HEADER.DBG_SWCLK: SCU_H.6
HEADER.DBG_SWDIO: SCU_H.7
HEADER.DBG_SWO: SCU_H.8
HEADER.USB_DM_PULLUP: SCU_H.5
JTAG.TCK: JTAG_H.1
JTAG.TDI: JTAG_H.3
JTAG.TDO: JTAG_H.2
JTAG.TMS: JTAG_H.4
UART1.RX: SCU_H.4
UART1.TX: SCU_H.3

### Buses and harness runs
bus FPGA_HEADER[0..83] = port FPGA_HEADER[0..83]
harness BOOT = port BOOT
harness HEADER = port HEADER
harness JTAG = port JTAG
harness UART1 = port UART1

### Notes on the sheet
- Headers
- 407fdd40

### Library data of the parts
FPGA_H_A FPGA_H_B = Header 20X2: Header, 20-Pin, Dual row; LatestRevisionDate: 17-Jul-2002; LatestRevisionNote: Re-released for DXP Platform.; Publisher: Altium Limited
FPGA_H_C JTAG_H = Header 2X2: Header, 2-Pin, Dual row; LatestRevisionDate: 17-Jul-2002; LatestRevisionNote: Re-released for DXP Platform.; Publisher: Altium Limited
POWER_H = Header 6X2: Header, 6-Pin, Dual row; LatestRevisionDate: 17-Jul-2002; LatestRevisionNote: Re-released for DXP Platform.; Publisher: Altium Limited
SCU_H = Header 4X2: Header, 4-Pin, Dual row; LatestRevisionDate: 17-Jul-2002; LatestRevisionNote: Re-released for DXP Platform.; Publisher: Altium Limited

## Sheet crystal.schdoc
size A4
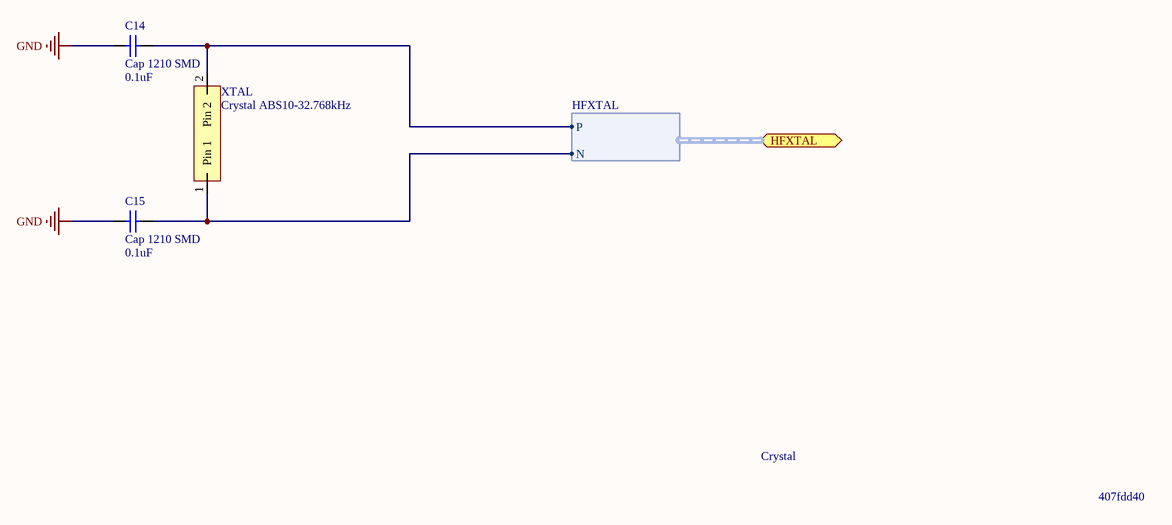
[diagram p13: crystal.schdoc]

### Parts
C14  Cap 1210 SMD  value 0.1uF  [CAPC1210(3225)100_L]
C15  Cap 1210 SMD  value 0.1uF  [CAPC1210(3225)100_L]
XTAL  Crystal ABS10-32.768kHz  [crystal-ABS10-32.768KHZ-T]

### Ports
HFXTAL (harness HFXTAL)

### Harnesses
HFXTAL: P, N

### Nets
GND: C14.2 C15.1
HFXTAL.N: C15.2 XTAL.1(Pin_1) ; port HFXTAL.N
HFXTAL.P: C14.1 XTAL.2(Pin_2) ; port HFXTAL.P

### Notes on the sheet
- Crystal
- 407fdd40

### Library data of the parts
C14 C15 = CMP-1038-00186-1: CAP 0.1uF 100V ±1% 1210 (3225 Metric) Thickness 1mm SMD; Case-EIA: 1210; Case-Metric: 3225; Rated Voltage: 100 V; Technology: SMT; Tolerance: ±1%; Max Thickness: 1 mm

## Sheet oscillator.SchDoc
size A4
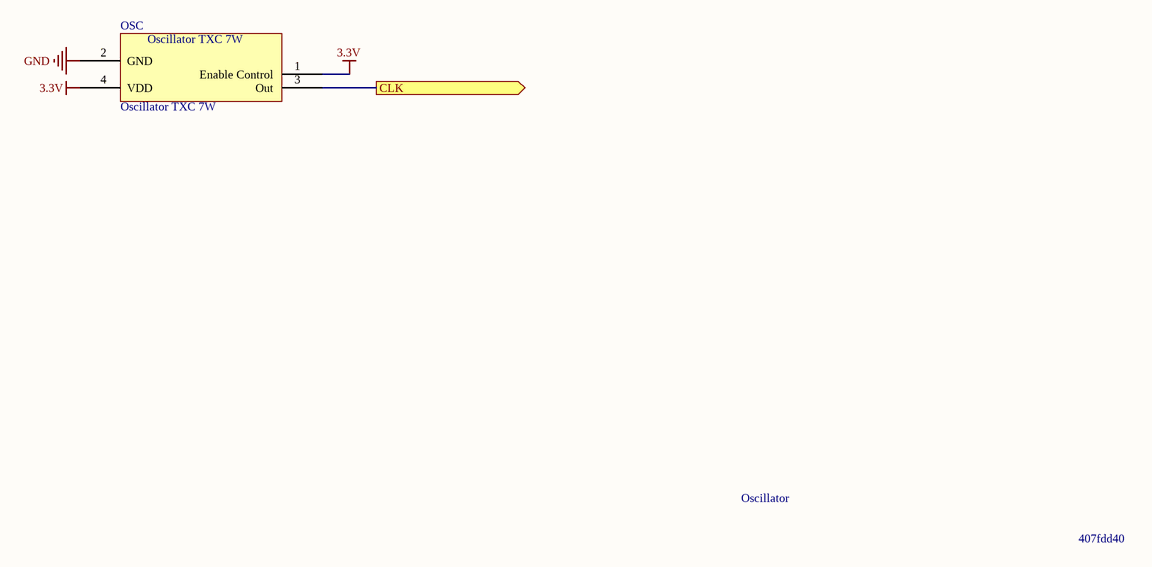
[diagram p14: oscillator.SchDoc]

### Parts
OSC  Oscillator TXC 7W  [TXC - 7W-60.000MBB-T]

### Ports
CLK (out)

### Nets
3.3V: OSC.1(Enable_Control) OSC.4(VDD)
GND: OSC.2(GND)
CLK: OSC.3(Out) ; port CLK

### Notes on the sheet
- Oscillator
- 407fdd40

## Sheet leds_logo.SchDoc
size A4
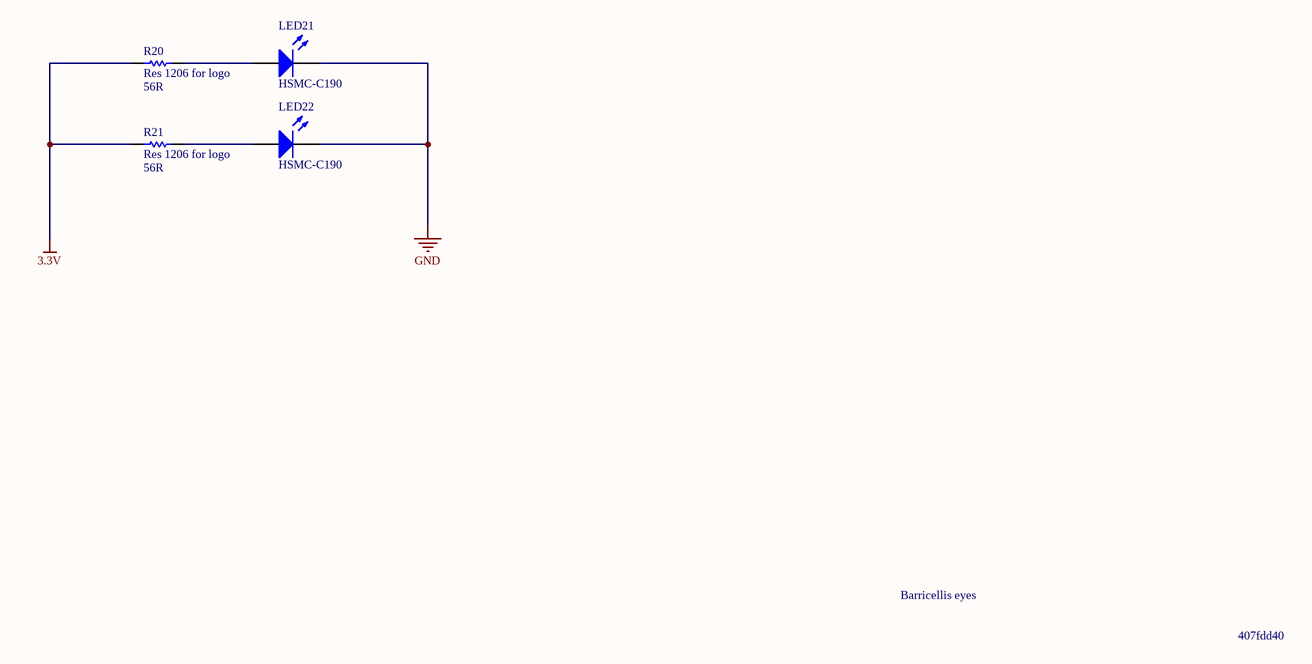
[diagram p15: leds_logo.SchDoc]

### Parts
LED21  HSMC-C190  [1.6X0.8X0.8]
LED22  HSMC-C190  [1.6X0.8X0.8]
R20  Res 1206 for logo  value 56R  [RESC1206(3216)_L]
R21  Res 1206 for logo  value 56R  [RESC1206(3216)_L]

### Nets
3.3V: R20.1 R21.1
GND: LED21.2(K) LED22.2(K)
NetLED21_1: LED21.1(A) R20.2
NetLED22_1: LED22.1(A) R21.2

### Notes on the sheet
- Barricellis eyes
- 407fdd40

### Library data of the parts
LED21 LED22 = HSMC-C190: as LED2 on sheet power_supply; Published: 11-Dec-2002; DatasheetVersion: 11-Mar-2002; PackageVersion: Mar-2002; PackageReference: 1.6X0.8X0.8; Publisher: Altium Limited; PackageDescription: SM LED; 2 Flat Leads; LED_Colour: Red; ComponentLink1Description: Manufacturer Link; ComponentLink1URL: http://www.avagotech.com/; ComponentLink2Description: Datasheet; ComponentLink2URL: http://cp.literature.agilent.com/litweb/pdf/5988-5891EN.pdf
R20 R21 = CMP-1014-00056-1: 56R 0.25W 5% 1206 (3216 Metric)  SMD; Case-Metric: 3216; Case-EIA: 1206; Technology: SMT; Tolerance: 5 %; Power: 0.25 W